# EAGLE design motionsensor (EAGLE 6.4)

## Sheet 1 of 3: Frontend
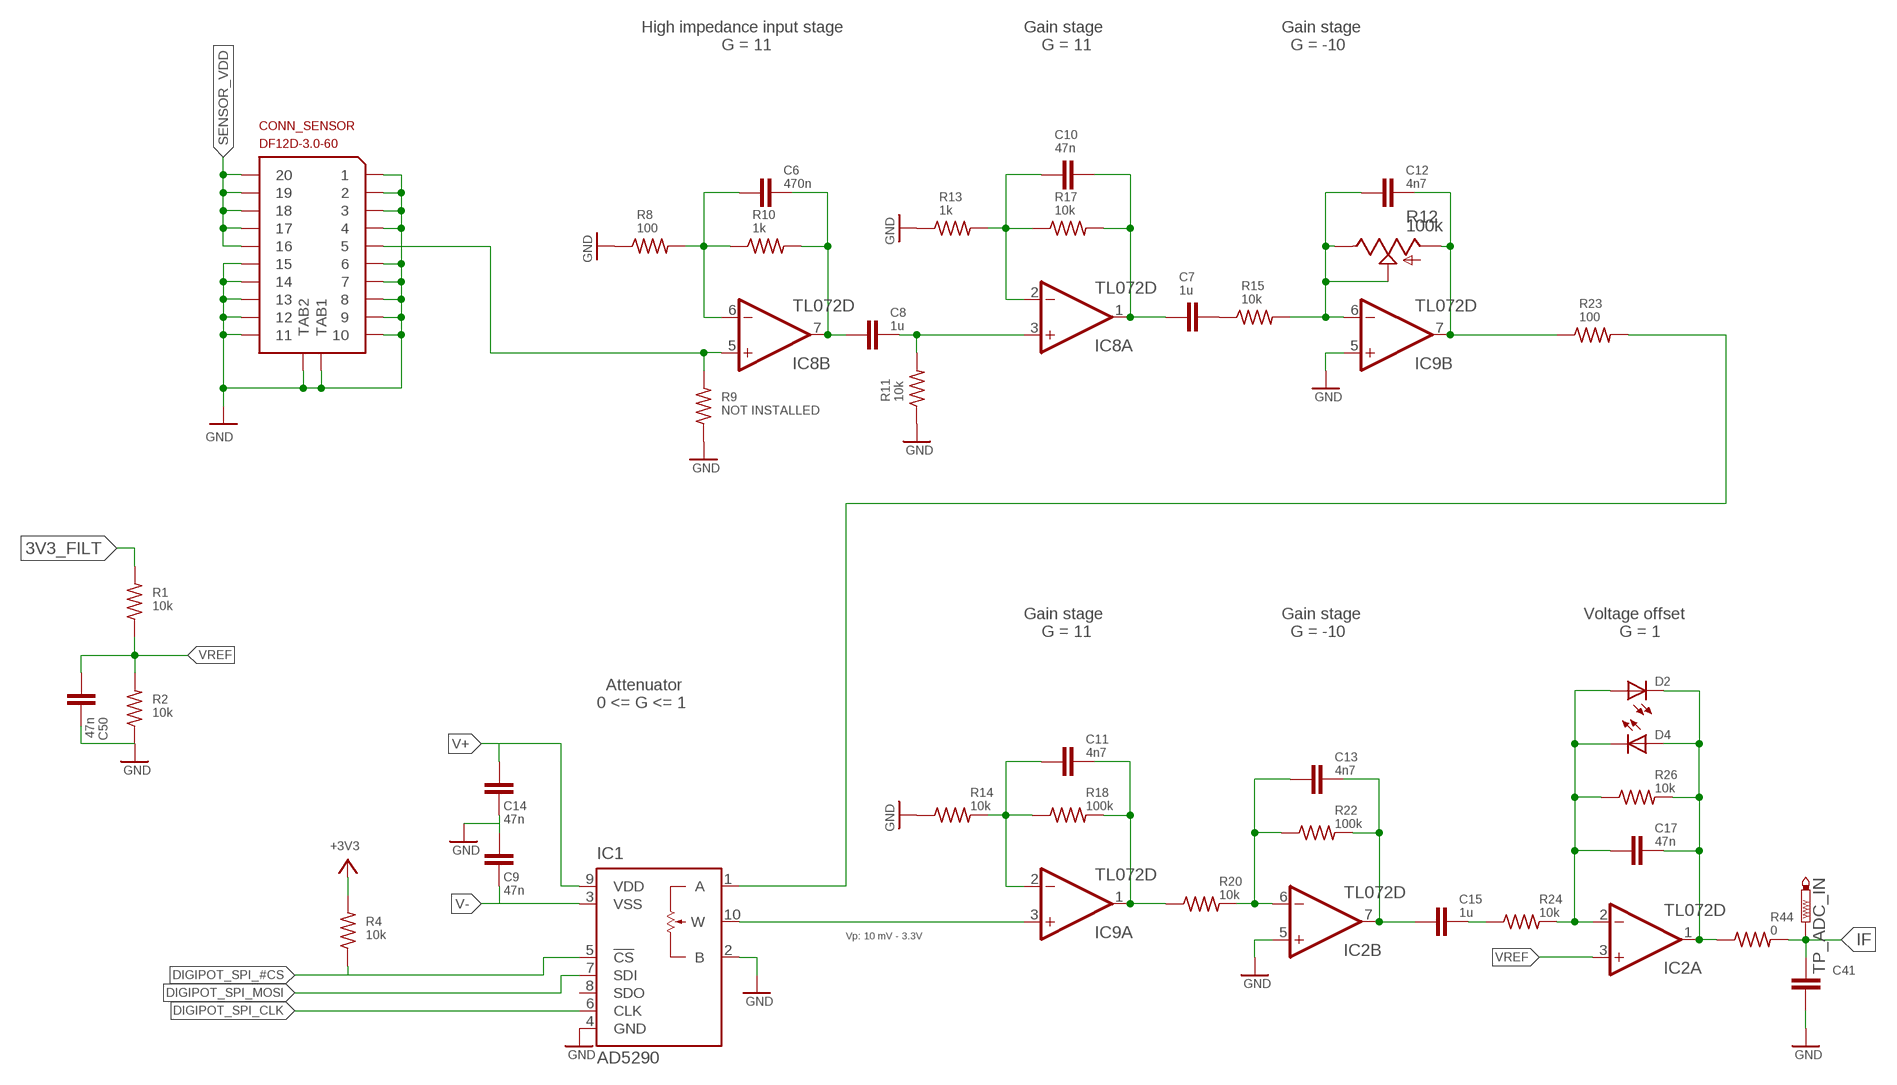
[diagram p0: schematic, sheet 1]

### Parts
C6  470n  C-EUC0603  [C0603]
C7  1u  C-EUC0603  [C0603]
C8  1u  C-EUC0603  [C0603]
C9  47n  C-EUC0603  [C0603]
C10  47n  C-EUC0603  [C0603]
C11  4n7  C-EUC0603  [C0603]
C12  4n7  C-EUC0603  [C0603]
C13  4n7  C-EUC0603  [C0603]
C14  47n  C-EUC0603  [C0603]
C15  1u  C-EUC0603  [C0603]
C17  47n  C-EUC0603  [C0603]
C41  C-EUC0603  [C0603]
C50  47n  C-EUC0603  [C0603]
CONN_SENSOR  DF12D-3.0-60  [DF12-3.0-60]
D2  LEDCHIPLED_0603  [CHIPLED_0603]
D4  LEDCHIPLED_0603  [CHIPLED_0603]
IC1  AD5290  ADS5290  [MSOP10]
IC2  TL072D  [SO08]
IC8  TL072D  [SO08]
IC9  TL072D  [SO08]
R1  10k  R-US_R0603  [R0603]
R2  10k  R-US_R0603  [R0603]
R4  10k  R-US_R0603  [R0603]
R8  100  R-US_R0603  [R0603]
R9  NOT INSTALLED  R-US_R0603  [R0603]
R10  1k  R-US_R0603  [R0603]
R11  10k  R-US_R0603  [R0603]
R12  100k  TRIM_US-3223G  [3223G]
R13  1k  R-US_R0603  [R0603]
R14  10k  R-US_R0603  [R0603]
R15  10k  R-US_R0603  [R0603]
R17  10k  R-US_R0603  [R0603]
R18  100k  R-US_R0603  [R0603]
R20  10k  R-US_R0603  [R0603]
R22  100k  R-US_R0603  [R0603]
R23  100  R-US_R0603  [R0603]
R24  10k  R-US_R0603  [R0603]
R26  10k  R-US_R0603  [R0603]
R44  0  R-US_R0603  [R0603]
TP_ADC_IN  PTR1B1,27  [B1,27]

### Nets
3V3_FILT: R1.2 ; also sheet 2,3
+3V3: R4.2 ; also sheet 2,3
DIGIPOT_SPI_#CS: IC1.5(!CS) R4.1 ; also sheet 2
DIGIPOT_SPI_CLK: IC1.6(CLK) ; also sheet 2
DIGIPOT_SPI_MOSI: IC1.7(SDI) ; also sheet 2
GND: C9.1 C14.2 C41.2 C50.2 CONN_SENSOR.P$1 CONN_SENSOR.P$2 CONN_SENSOR.P$3 CONN_SENSOR.P$4 CONN_SENSOR.P$6 CONN_SENSOR.P$7 CONN_SENSOR.P$8 CONN_SENSOR.P$9 CONN_SENSOR.P$10 CONN_SENSOR.P$11 CONN_SENSOR.P$12 CONN_SENSOR.P$13 CONN_SENSOR.P$14 CONN_SENSOR.P$15 CONN_SENSOR.TAB1 CONN_SENSOR.TAB2 IC1.2(B) IC1.4(GND) IC2.5(B:+IN) IC9.5(B:+IN) R2.1 R8.1 R9.1 R11.1 R13.1 R14.1 ; also sheet 2,3
IF: C41.1 R44.2 TP_ADC_IN.TP ; also sheet 2
N$1: C6.1 IC8.6(B:-IN) R8.2 R10.1
N$2: C6.2 C8.1 IC8.7(B:OUT) R10.2
N$3: CONN_SENSOR.P$5 IC8.5(B:+IN) R9.2
N$4: C7.2 R15.1
N$5: C10.1 IC8.2(A:-IN) R13.2 R17.1
N$6: C7.1 C10.2 IC8.1(A:OUT) R17.2
N$7: C8.2 IC8.3(A:+IN) R11.2
N$8: C12.1 IC9.6(B:-IN) R12.2(S) R12.3(E) R15.2
N$9: C12.2 IC9.7(B:OUT) R12.1(A) R23.1
N$11: IC1.1(A) R23.2
N$14: C11.1 IC9.2(A:-IN) R14.2 R18.1
N$15: C11.2 IC9.1(A:OUT) R18.2 R20.1
N$17: C13.1 IC2.6(B:-IN) R20.2 R22.1
N$18: C13.2 C15.1 IC2.7(B:OUT) R22.2
N$21: C15.2 R24.1
N$22: IC1.10(W) IC9.3(A:+IN)
N$28: C17.1 D2.A D4.C IC2.2(A:-IN) R24.2 R26.1
N$42: C17.2 D2.C D4.A IC2.1(A:OUT) R26.2 R44.1
SENSOR_VDD: CONN_SENSOR.P$16 CONN_SENSOR.P$17 CONN_SENSOR.P$18 CONN_SENSOR.P$19 CONN_SENSOR.P$20 ; also sheet 3
V+: C14.1 IC1.9(VDD) ; also sheet 3
V-: C9.2 IC1.3(VSS) ; also sheet 3
VREF: C50.1 IC2.3(A:+IN) R1.1 R2.2
Unconnected: IC1.8(SDO)

### Notes on the sheet
- High impedance input stage | Gain stage | Gain stage
- G = 11 | G = 11 | G = -10
- Gain stage | Gain stage | Voltage offset
- G = 11 | G = -10 | G = 1
- Attenuator
- 0 <= G <= 1
- Vp: 10 mV - 3.3V

## Sheet 2 of 3: MCU
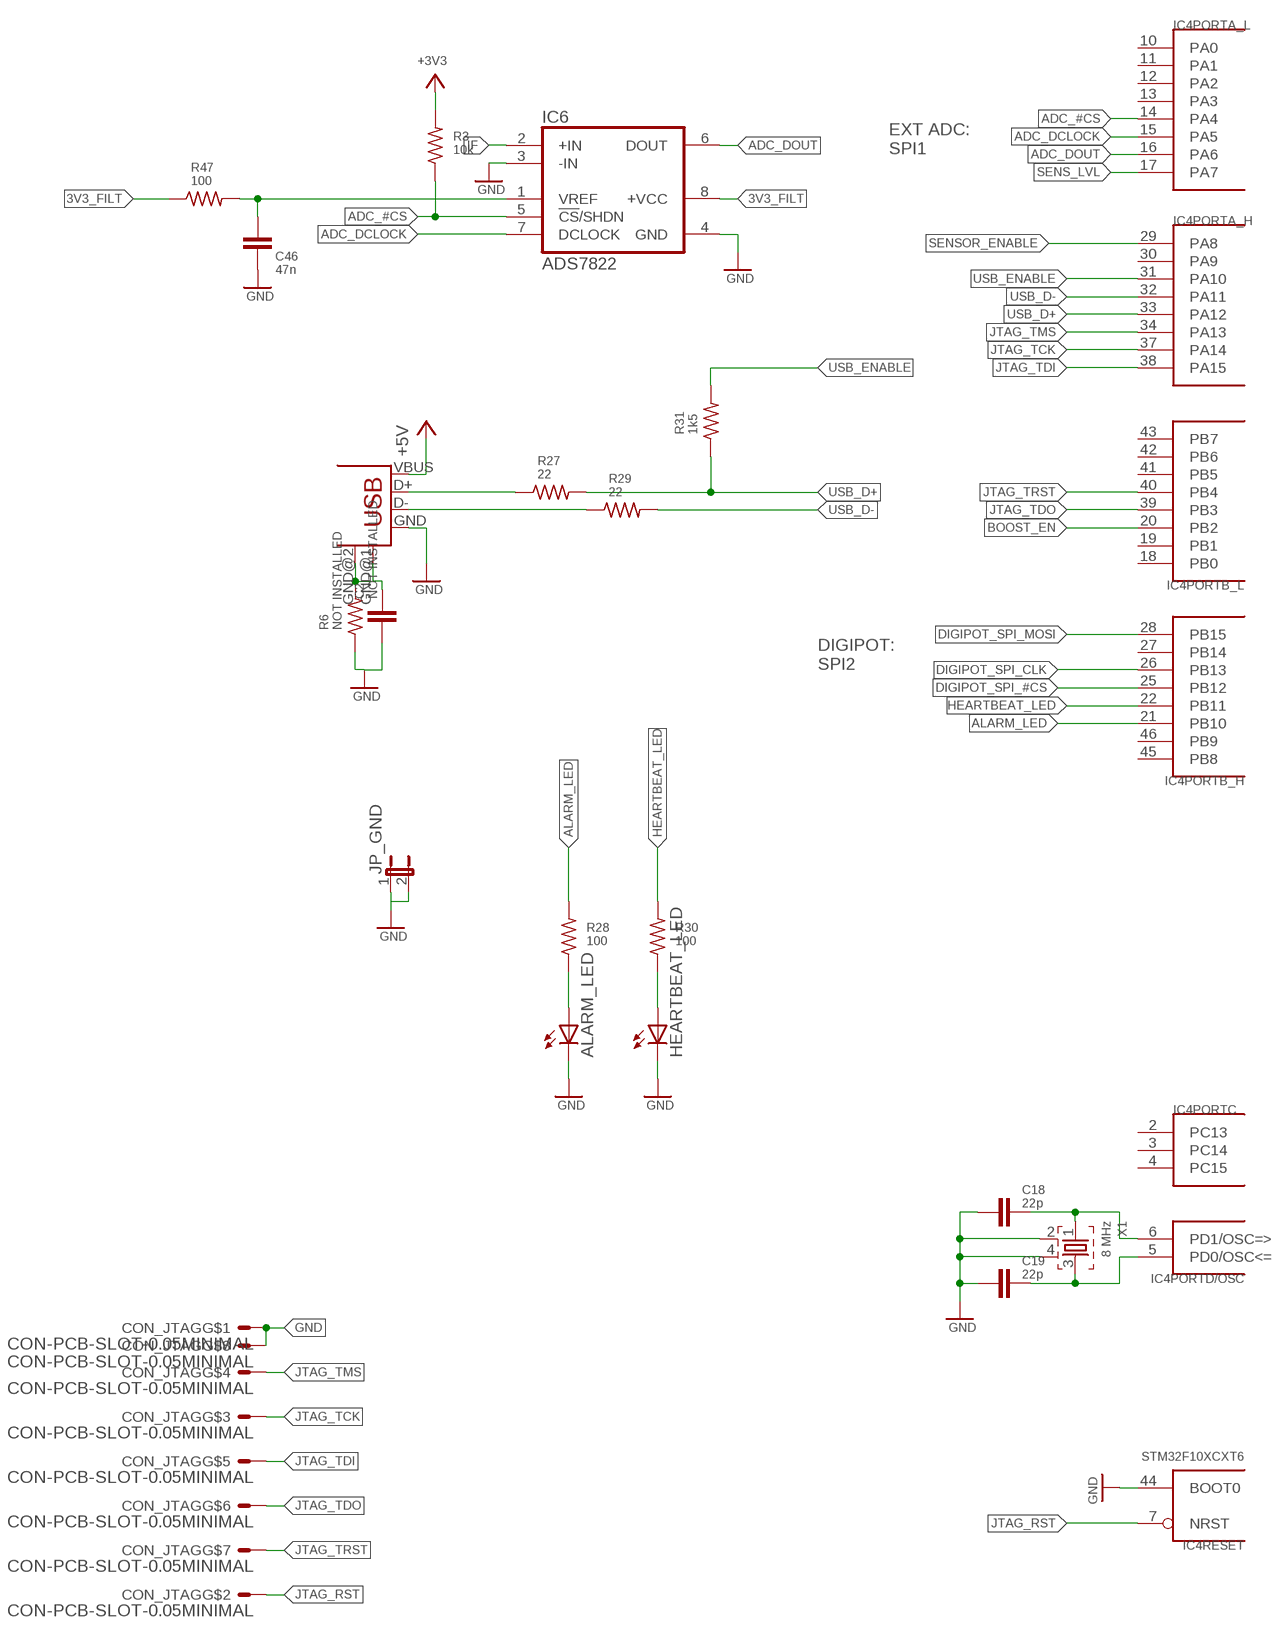
[diagram p1: schematic, sheet 2]

### Parts
ALARM_LED  LED3MM  [LED3MM]
C2  NOT INSTALLED  C-EUC0603  [C0603]
C18  22p  C-EUC0603  [C0603]
C19  22p  C-EUC0603  [C0603]
C46  47n  C-EUC0603  [C0603]
CON_JTAG  CON-PCB-SLOT-0.05MINIMAL  [CONN_SLOT_MINIMAL]
CON_USB  USB-VERT  [USB-MB-V]
HEARTBEAT_LED  LED3MM  [LED3MM]
IC4  STM32F10XCXT6  [TQFP48]
IC6  ADS7822  ADS1286U  [SO08]
JP_GND  JP1E  [JP1]
R3  10k  R-US_R0603  [R0603]
R6  NOT INSTALLED  R-US_R0603  [R0603]
R27  22  R-US_R0603  [R0603]
R28  100  R-US_R0603  [R0603]
R29  22  R-US_R0603  [R0603]
R30  100  R-US_R0603  [R0603]
R31  1k5  R-US_R0603  [R0603]
R47  100  R-US_R0603  [R0603]
X1  8 MHz  CTS406-SHIELD  [CTS406]

### Nets
3V3_FILT: IC6.8(+VCC) R47.1 ; also sheet 1,3
+3V3: R3.2 ; also sheet 1,3
ADC_#CS: IC4.14(PORTA_L:PA4) IC6.5(!CS!/SHDN) R3.1
ADC_DCLOCK: IC4.15(PORTA_L:PA5) IC6.7(DCLOCK)
ADC_DOUT: IC4.16(PORTA_L:PA6) IC6.6(DOUT)
ALARM_LED: IC4.21(PORTB_H:PB10) R28.2
BOOST_EN: IC4.20(PORTB_L:PB2) ; also sheet 3
DIGIPOT_SPI_#CS: IC4.25(PORTB_H:PB12) ; also sheet 1
DIGIPOT_SPI_CLK: IC4.26(PORTB_H:PB13) ; also sheet 1
DIGIPOT_SPI_MOSI: IC4.28(PORTB_H:PB15) ; also sheet 1
GND: ALARM_LED.K(C) C2.1 C18.1 C19.1 C46.2 CON_JTAG.1 CON_JTAG.8 CON_USB.GND HEARTBEAT_LED.K(C) IC4.44(RESET:BOOT0) IC6.3(-IN) IC6.4(GND) JP_GND.1 JP_GND.2 R6.1 X1.2 X1.4 ; also sheet 1,3
HEARTBEAT_LED: IC4.22(PORTB_H:PB11) R30.2
IF: IC6.2(+IN) ; also sheet 1
JTAG_RST: CON_JTAG.2 IC4.7(RESET:NRST)
JTAG_TCK: CON_JTAG.3 IC4.37(PORTA_H:PA14)
JTAG_TDI: CON_JTAG.5 IC4.38(PORTA_H:PA15)
JTAG_TDO: CON_JTAG.6 IC4.39(PORTB_L:PB3)
JTAG_TMS: CON_JTAG.4 IC4.34(PORTA_H:PA13)
JTAG_TRST: CON_JTAG.7 IC4.40(PORTB_L:PB4)
N$13: C2.2 CON_USB.GND@1(GND) CON_USB.GND@2(GND) R6.2
N$20: CON_USB.D+ R27.1
N$36: C46.1 IC6.1(VREF) R47.2
N$43: CON_USB.D- R29.1
N$44: C19.2 IC4.5(PORTD/OSC:PD0/OSC<=) X1.3
N$45: C18.2 IC4.6(PORTD/OSC:PD1/OSC=>) X1.1
N$46: ALARM_LED.A R28.1
N$47: HEARTBEAT_LED.A R30.1
SENS_LVL: IC4.17(PORTA_L:PA7)
SENSOR_ENABLE: IC4.29(PORTA_H:PA8) ; also sheet 3
USB_+5V: CON_USB.VBUS ; supply symbol labelled +5V ; also sheet 3
USB_D+: IC4.33(PORTA_H:PA12) R27.2 R31.1
USB_D-: IC4.32(PORTA_H:PA11) R29.2
USB_ENABLE: IC4.31(PORTA_H:PA10) R31.2
Unconnected: IC4.2(PORTC:PC13) IC4.3(PORTC:PC14) IC4.4(PORTC:PC15) IC4.10(PORTA_L:PA0) IC4.11(PORTA_L:PA1) IC4.12(PORTA_L:PA2) IC4.13(PORTA_L:PA3) IC4.18(PORTB_L:PB0) IC4.19(PORTB_L:PB1) IC4.27(PORTB_H:PB14) IC4.30(PORTA_H:PA9) IC4.41(PORTB_L:PB5) IC4.42(PORTB_L:PB6) IC4.43(PORTB_L:PB7) IC4.45(PORTB_H:PB8) IC4.46(PORTB_H:PB9)

### Notes on the sheet
- EXT ADC:
  SPI1
- DIGIPOT:
  SPI2

## Sheet 3 of 3: Power
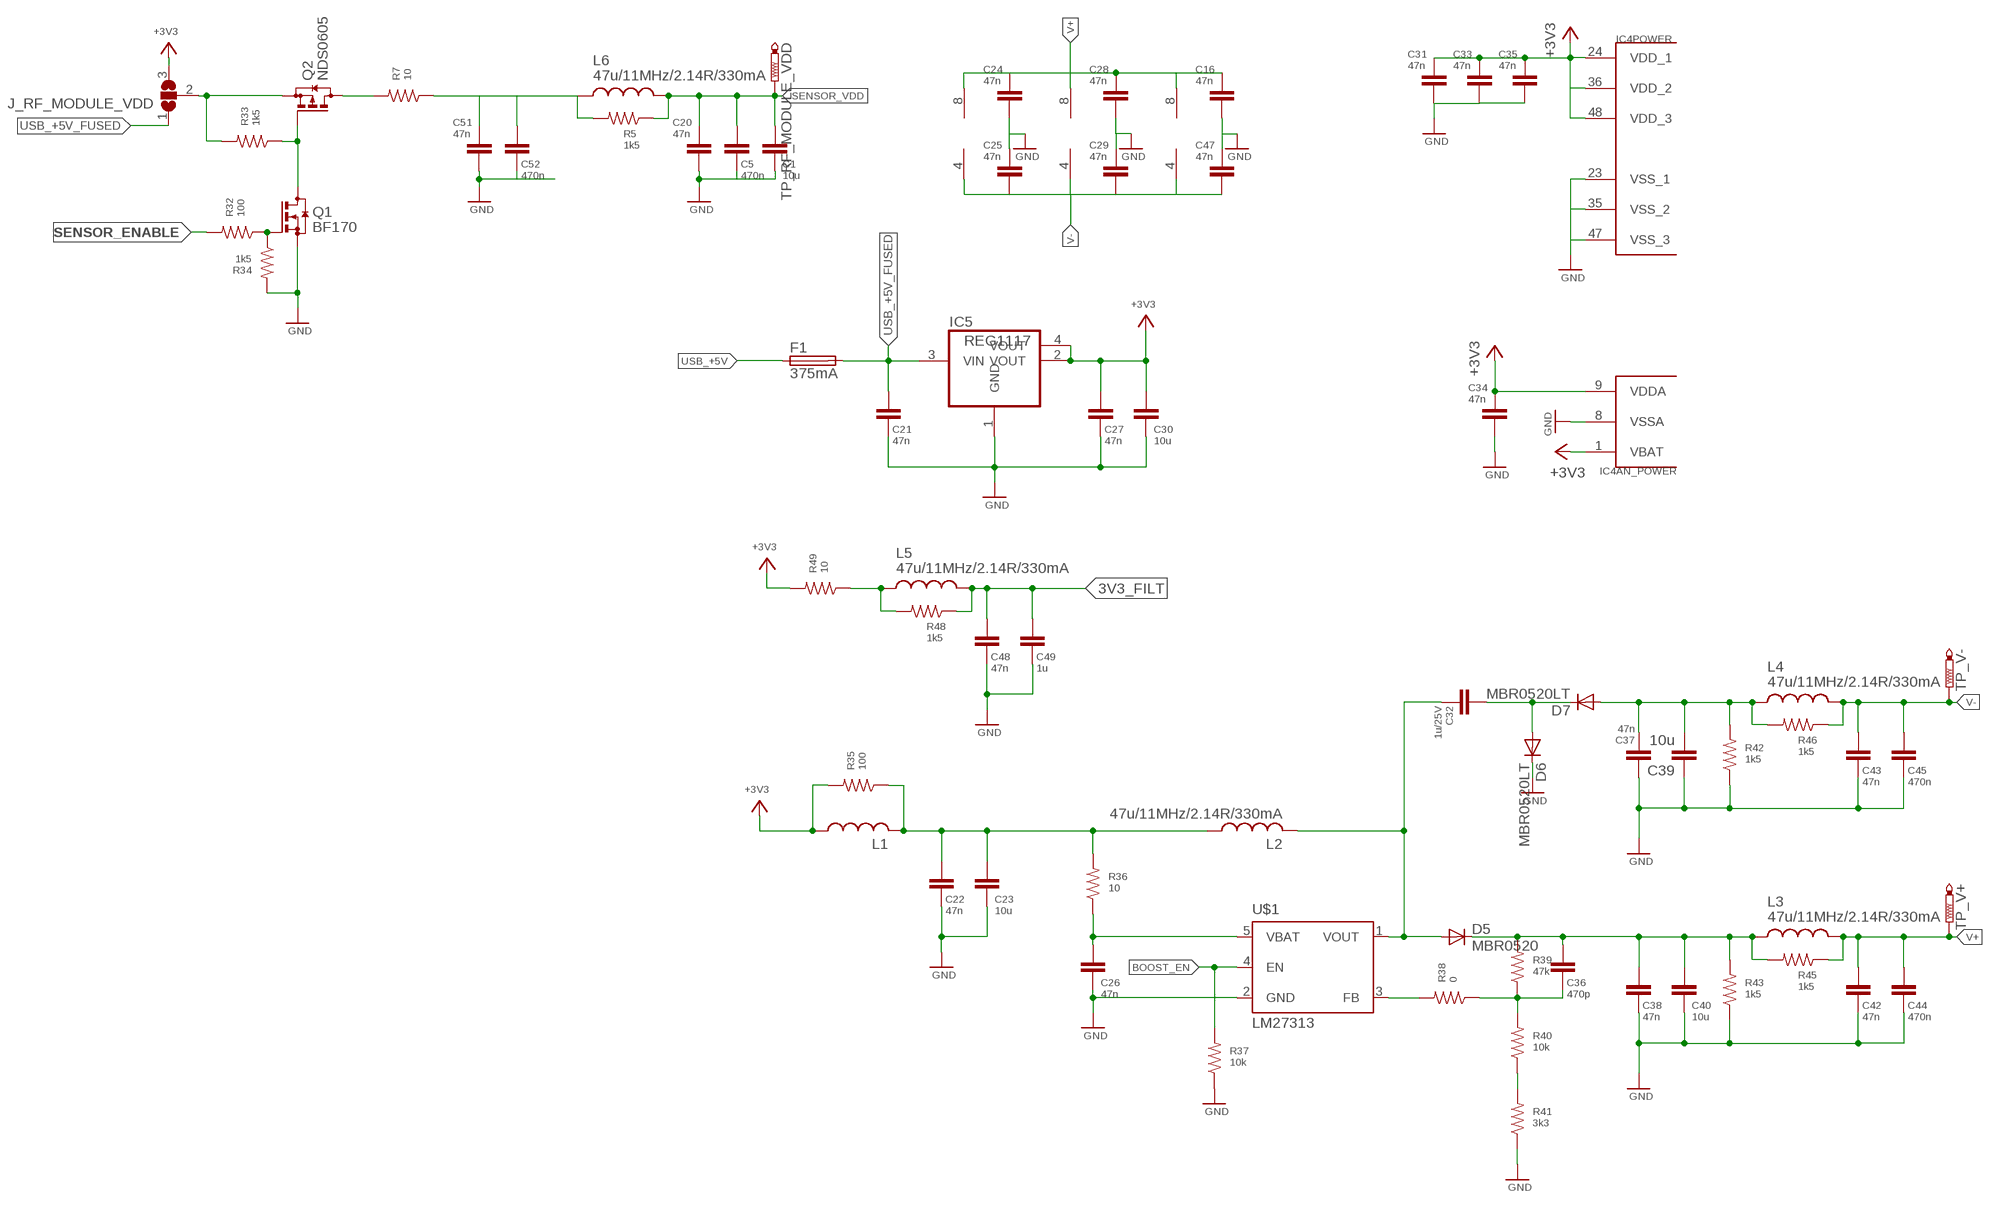
[diagram p2: schematic, sheet 3]

### Parts
C1  10u  C-EUC1206  [C1206]
C5  470n  C-EUC0603  [C0603]
C16  47n  C-EUC0603  [C0603]
C20  47n  C-EUC0603  [C0603]
C21  47n  C-EUC0603  [C0603]
C22  47n  C-EUC0603  [C0603]
C23  10u  C-EUC1206  [C1206]
C24  47n  C-EUC0603  [C0603]
C25  47n  C-EUC0603  [C0603]
C26  47n  C-EUC1206  [C1206]
C27  47n  C-EUC0603  [C0603]
C28  47n  C-EUC0603  [C0603]
C29  47n  C-EUC0603  [C0603]
C30  10u  C-EUC1206  [C1206]
C31  47n  C-EUC0603  [C0603]
C32  1u/25V  C-EUC0603  [C0603]
C33  47n  C-EUC0603  [C0603]
C34  47n  C-EUC0603  [C0603]
C35  47n  C-EUC0603  [C0603]
C36  470p  C-EUC0603  [C0603]
C37  47n  C-EUC0603  [C0603]
C38  47n  C-EUC0603  [C0603]
C39  10u  C-EUC1206  [C1206]
C40  10u  C-EUC1206  [C1206]
C42  47n  C-EUC0603  [C0603]
C43  47n  C-EUC0603  [C0603]
C44  470n  C-EUC0603  [C0603]
C45  470n  C-EUC0603  [C0603]
C47  47n  C-EUC0603  [C0603]
C48  47n  C-EUC0603  [C0603]
C49  1u  C-EUC0603  [C0603]
C51  47n  C-EUC0603  [C0603]
C52  470n  C-EUC0603  [C0603]
D5  MBR0520  MBR0520LT  [SOD123]
D6  MBR0520LT  [SOD123]
D7  MBR0520LT  [SOD123]
F1  375mA  FUSE-0603  [0603]
IC5  REG1117  [SOT223]
J_RF_MODULE_VDD  SJ2W  [SJ_2]
L1  L-USL2012C  [L2012C]
L2  47u/11MHz/2.14R/330mA  L-US1210  [R1210]
L3  47u/11MHz/2.14R/330mA  L-US1210  [R1210]
L4  47u/11MHz/2.14R/330mA  L-US1210  [R1210]
L5  47u/11MHz/2.14R/330mA  L-US1210  [R1210]
L6  47u/11MHz/2.14R/330mA  L-US1210  [R1210]
Q1  BF170  BSS123  [SOT23]
Q2  NDS0605  BSS84  [SOT23]
R5  1k5  R-US_R0603  [R0603]
R7  10  R-US_R0603  [R0603]
R32  100  R-US_R0603  [R0603]
R33  1k5  R-US_R0603  [R0603]
R34  1k5  R-US_R0603  [R0603]
R35  100  R-US_R0603  [R0603]
R36  10  R-US_R0603  [R0603]
R37  10k  R-US_R0603  [R0603]
R38  0  R-US_R0603  [R0603]
R39  47k  R-US_R0603  [R0603]
R40  10k  R-US_R0603  [R0603]
R41  3k3  R-US_R0603  [R0603]
R42  1k5  R-US_R0603  [R0603]
R43  1k5  R-US_R0603  [R0603]
R45  1k5  R-US_R0603  [R0603]
R46  1k5  R-US_R0603  [R0603]
R48  1k5  R-US_R0603  [R0603]
R49  10  R-US_R0603  [R0603]
TP_RF_MODULE_VDD  PTR1B1,27  [B1,27]
TP_V+  PTR1B1,27  [B1,27]
TP_V-  PTR1B1,27  [B1,27]
U$1  LM27313  NCP5006  [TSOP5]

### Nets
3V3_FILT: C48.1 C49.1 L5.2 R48.1 ; also sheet 1,2
+3V3: C27.1 C30.1 C31.2 C33.2 C34.2 C35.2 IC4.1(AN_POWER:VBAT) IC4.9(AN_POWER:VDDA) IC4.24(POWER:VDD_1) IC4.36(POWER:VDD_2) IC4.48(POWER:VDD_3) IC5.2(VOUT) IC5.4(VOUT) J_RF_MODULE_VDD.3 L1.1 R35.2 R49.2 ; also sheet 1,2
+3V3_FILT: C22.1 C23.1 L1.2 L2.1 R35.1 R36.2
BOOST_EN: R37.2 U$1.4(EN) ; also sheet 2
GND: C1.2 C5.2 C16.1 C20.1 C21.2 C22.2 C23.2 C24.1 C25.2 C26.2 C27.2 C28.1 C29.2 C30.2 C31.1 C33.1 C34.1 C35.1 C37.1 C38.2 C39.1 C40.2 C42.2 C43.2 C44.2 C45.2 C47.2 C48.2 C49.2 C51.1 C52.2 D6.C IC4.8(AN_POWER:VSSA) IC4.23(POWER:VSS_1) IC4.35(POWER:VSS_2) IC4.47(POWER:VSS_3) IC5.1(GND) Q1.2(S) R34.2 R37.1 R41.1 R42.1 R43.1 U$1.2(GND) ; also sheet 1,2
N$10: J_RF_MODULE_VDD.2 Q2.2(S) R33.2
N$12: Q2.3(D) R7.2
N$29: Q1.1(G) R32.1 R34.1
N$30: L5.1 R48.2 R49.1
N$31: Q1.3(D) Q2.1(G) R33.1
N$34: C32.2 D5.A L2.2 U$1.1(VOUT)
N$37: C26.1 R36.1 U$1.5(VBAT)
N$38: C32.1 D6.A D7.C
N$39: C36.2 R38.1 R39.1 R40.2
N$40: R40.1 R41.2
N$41: R38.2 U$1.3(FB)
N$141: C37.2 C39.2 D7.A L4.1 R42.2 R46.2
N$522: C36.1 C38.1 C40.1 D5.C L3.1 R39.2 R43.2 R45.2
SENSOR_ENABLE: R32.2 ; also sheet 2
SENSOR_VDD: C1.1 C5.1 C20.2 L6.2 R5.1 TP_RF_MODULE_VDD.TP ; also sheet 1
SENSOR_VDD1: C51.2 C52.1 L6.1 R5.2 R7.1
USB_+5V: F1.1 ; also sheet 2
USB_+5V_FUSED: C21.1 F1.2 IC5.3(VIN) J_RF_MODULE_VDD.1
V+: C16.2 C24.2 C28.2 C42.1 C44.1 IC2.8(P:V+) IC8.8(P:V+) IC9.8(P:V+) L3.2 R45.1 TP_V+.TP ; also sheet 1
V-: C25.1 C29.1 C43.1 C45.1 C47.1 IC2.4(P:V-) IC8.4(P:V-) IC9.4(P:V-) L4.2 R46.1 TP_V-.TP ; also sheet 1

## Library data of the parts
ALARM_LED D2 D4 HEARTBEAT_LED = led:LED: LED OSRAM: - CHIPLED LG R971, LG N971, LY N971, LG Q971, LY Q971, LO R971, LY R971 LH N974, LH R974 LS Q976, LO Q976, LY Q976 LO Q996 - Hyper CHIPLED LW Q18S LB Q993, LB Q99A, LB R99A - SideLED LS A670, LO A670, LY A670, LG A670, LP A670 LB A673, LV A673, LT A673, LW A673 LH A674 LY A675 LS A676, LA A676, LO A676, LY A676, LW A676 LS A679, LY A679, LG A679 - Hyper Micro SIDELED® LS Y876, LA Y876, LO Y876, LY Y876 LT Y87S - SmartLED LW L88C, LW L88S LB L89C, LB L89S, LG L890 LS L89K, LO L89K, LY L89K LS L896, LA L896, LO L896, LY L896 - TOPLED LS T670, LO T670, LY T670, LG T670, LP T670 LSG T670, LSP T670, LSY T670, LOP T670, LYG T670 LG T671, LOG T671, LSG T671 LB T673, LV T673, LT T673, LW T673 LH T674 LS T676, LA T676, LO T676, LY T676, LB T676, LH T676, LSB T676, LW T676 LB T67C, LV T67C, LT T67C, LS T67K, LO T67K, LY T67K, LW E67C LS E67B, LA E67B, LO E67B, LY E67B, LB E67C, LV E67C, LT E67C LW T67C LS T679, LY T679, LG T679 LS T770, LO T770, LY T770, LG T770, LP T770 LB T773, LV T773, LT T773, LW T773 LH T774 LS E675, LA E675, LY E675, LS T675 LS T776, LA T776, LO T776, LY T776, LB T776 LHGB T686 LT T68C, LB T68C - Hyper Mini TOPLED® LB M676 - Mini TOPLED Santana® LG M470 LS M47K, LO M47K, LY M47K Source: http://www.osram.convergy.de LUXEON: - LUMILED® LXK2-PW12-R00, LXK2-PW12-S00, LXK2-PW14-U00, LXK2-PW14-V00 LXK2-PM12-R00, LXK2-PM12-S00, LXK2-PM14-U00 LXK2-PE12-Q00, LXK2-PE12-R00, LXK2-PE12-S00, LXK2-PE14-T00, LXK2-PE14-U00 LXK2-PB12-K00, LXK2-PB12-L00, LXK2-PB12-M00, LXK2-PB14-N00, LXK2-PB14-P00, LXK2-PB14-Q00 LXK2-PR12-L00, LXK2-PR12-M00, LXK2-PR14-Q00, LXK2-PR14-R00 LXK2-PD12-Q00, LXK2-PD12-R00, LXK2-PD12-S00 LXK2-PH12-R00, LXK2-PH12-S00 LXK2-PL12-P00, LXK2-PL12-Q00, LXK2-PL12-R00 Source: www.luxeon.com KINGBRIGHT: KA-3528ASYC Source: www.kingbright.com
C1 C2 C5-C52 = rcl:C-EU: CAPACITOR, European symbol
CON_JTAG = con-pcb-slot:CON-PCB-SLOT-0.05: PCB slot (edge) connector with 0.05" pitch (based on conventional PCI)
CON_USB = con-usb-2:USB: USB Connectors
CONN_SENSOR = con-hirose-DF12-20:DF12D-3.0-60
D5-D7 = diode:MBR0520LT: SCHOTTKY BARRIER RECTIFIER Source: http://onsemi.com .. MBR0520LT1-D.pdf
F1 = fuse-0603:FUSE-0603
IC1 = ADS5290:ADS5290: Single +15 V/±5 V, 256-Position, I2C-Compatible Digital Potentiometer Source: http://www.analog.com/static/imported-files/data_sheets/AD5280_5282.pdf
IC2 IC8 IC9 = linear:TL072: OP AMP
IC4 = stm32:STM32F10XCXT6: ST STM32F101/103 48pin LQFP
IC5 = burr-brown:REG1117: 800mA and 1A Low Dropout (LDO) Positive Regulator 1.8V, 2.5V, 2.85V, 3.3V, 5V, and Adj; MPN: REG1117; OC_FARNELL: 1097566; OC_NEWARK: 14P6981
IC6 = burr-brown:ADS1286: 12-Bit Micro Power Sampling ADC; MF: TEXAS INSTRUMENTS; MPN: ADS1286U; OC_FARNELL: 1106203; OC_NEWARK: 80K5544
J_RF_MODULE_VDD = jumper:SJ2W: SMD solder JUMPER
JP_GND = jumper:JP1E: JUMPER
L1 = rcl:L-US: INDUCTOR, American symbol
L2-L6 = rcl - Copy:L-US: INDUCTOR, American symbol
Q1 = transistor-small-signal:BSS123: N-CHANNEL MOS FET
Q2 = transistor-small-signal:BSS84: P-CHANNEL MOS FET
R1-R11 R13-R15 R17 R18 R20 R22-R24 R26-R49 = rcl:R-US_: RESISTOR, American symbol
R12 = pot:TRIM_US-: POTENTIOMETER
TP_ADC_IN TP_RF_MODULE_VDD TP_V+ TP_V- = testpad:PTR1: TEST PIN
U$1 = ncp5006:NCP5006
X1 = crystal:CTS406-SHIELD

## Board
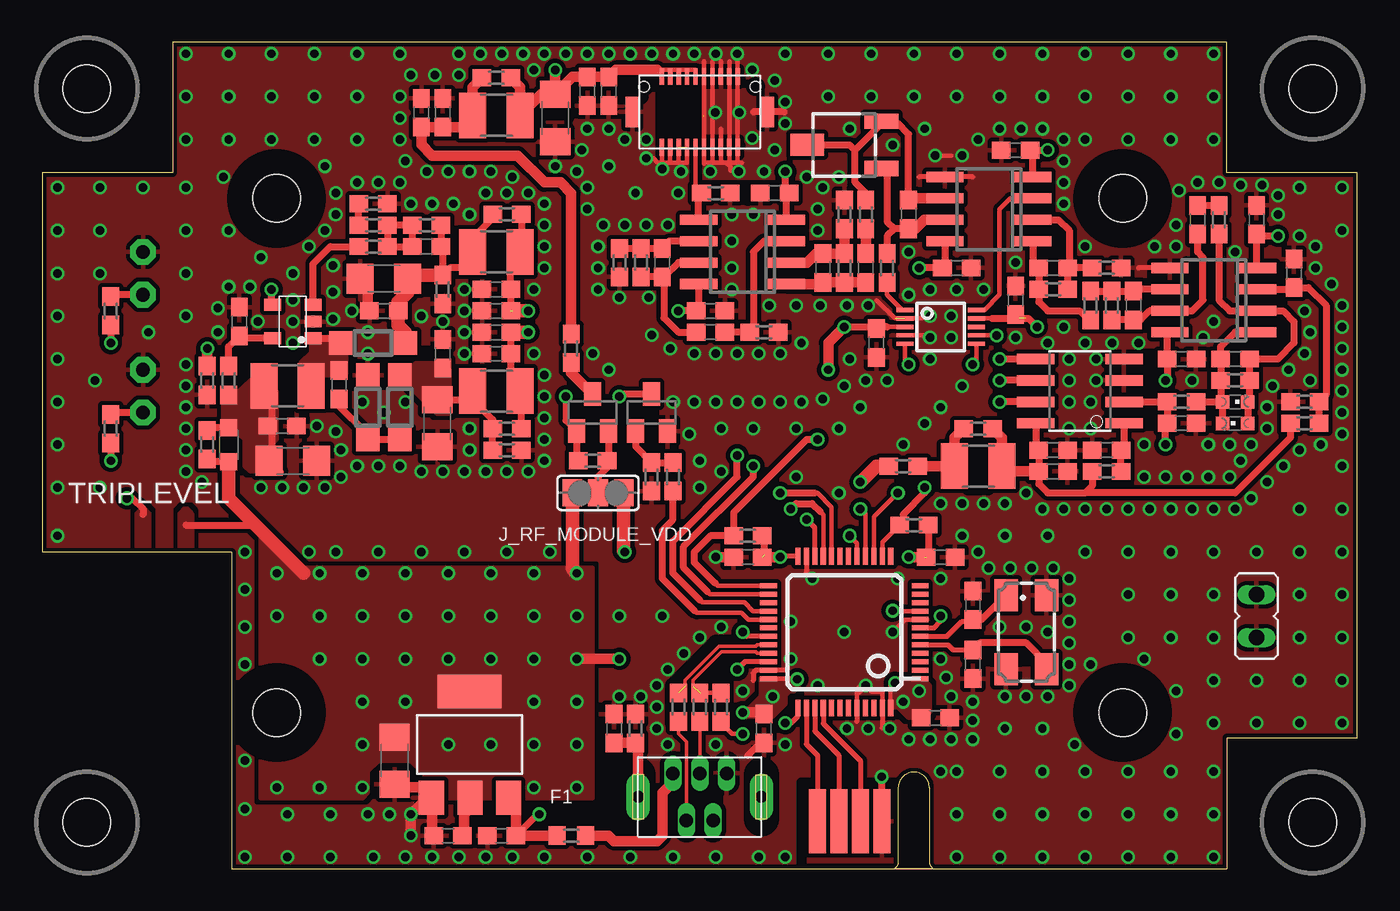
[diagram p3: board, top side]
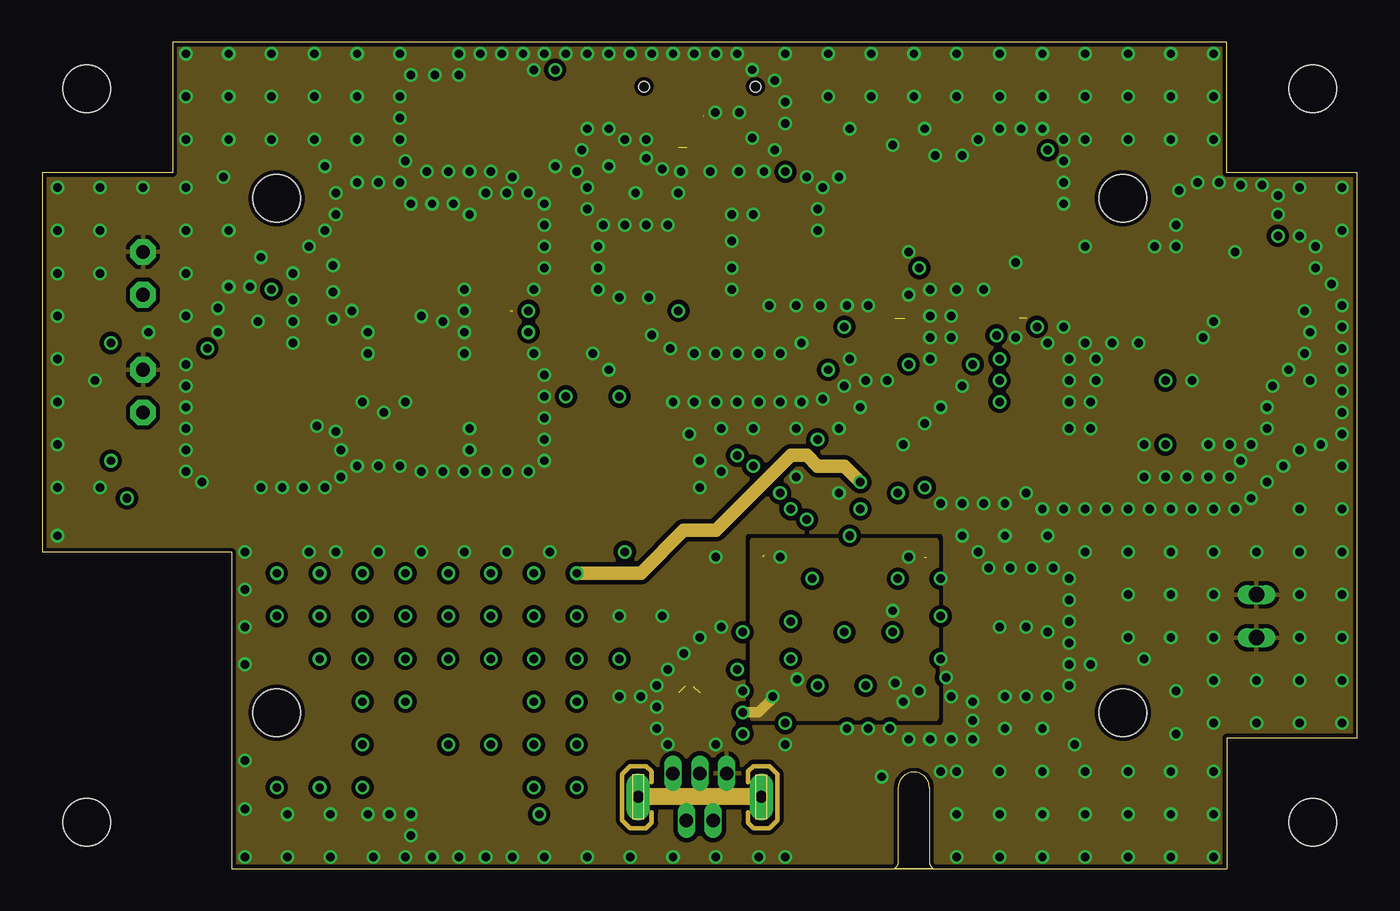
[diagram p4: board, inner layer Route2]
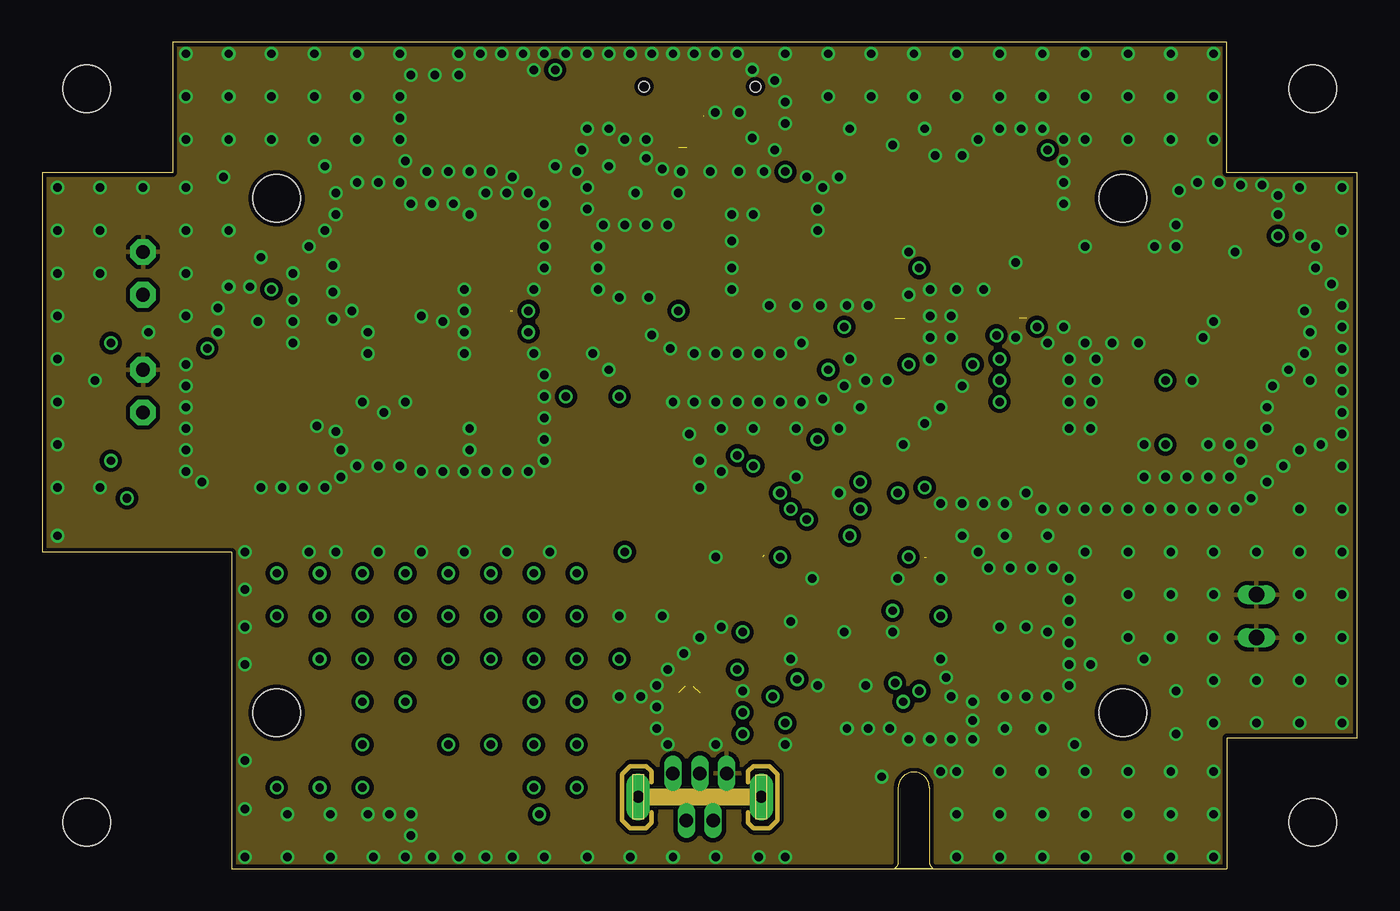
[diagram p5: board, inner layer Route15]
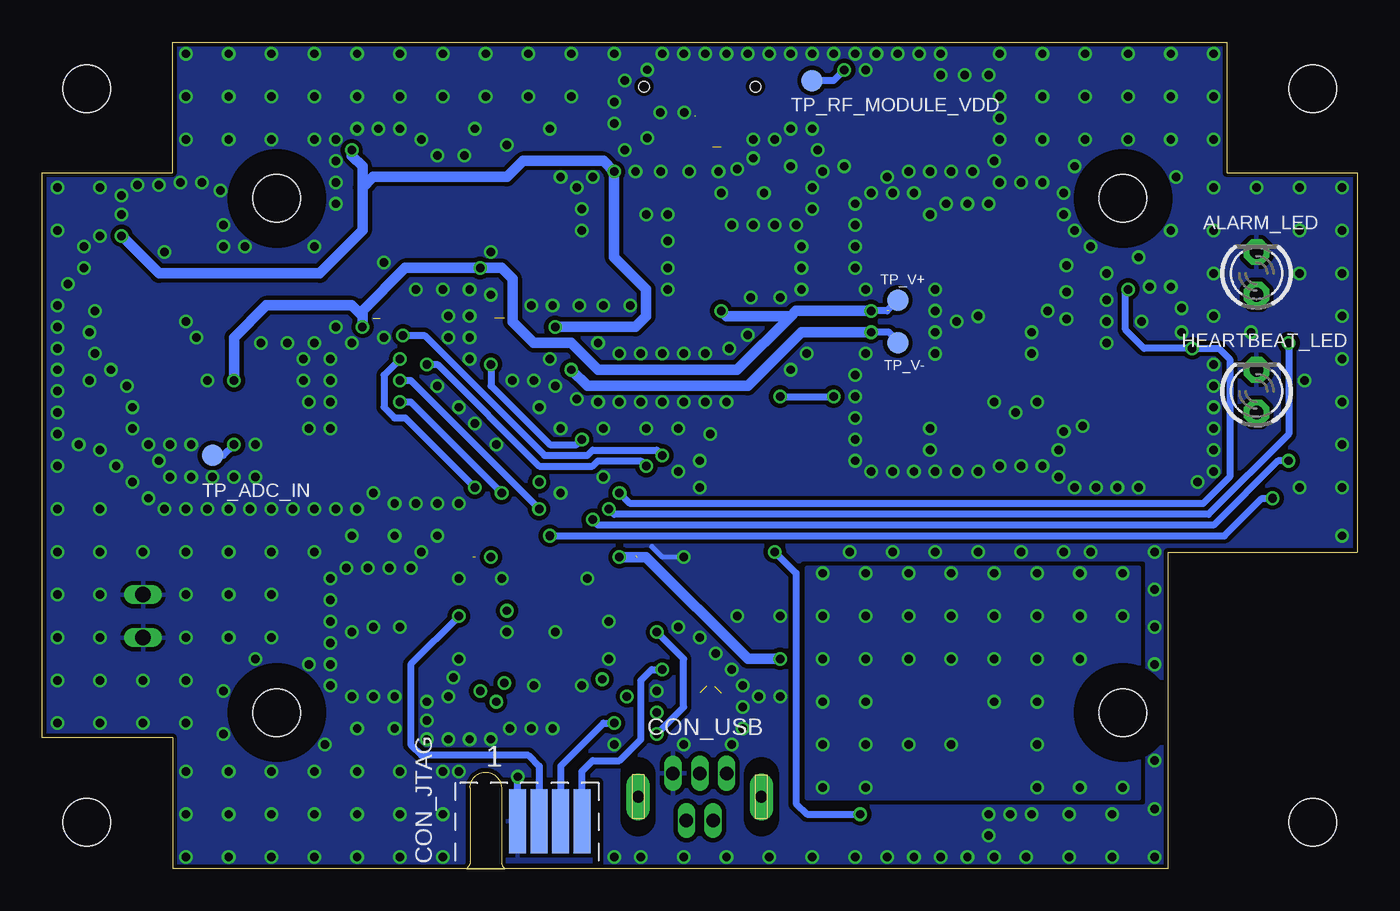
[diagram p6: board, bottom side, seen from below]

Size 78 x 49 mm. Coordinates in mm from the lower left corner, seen from the top.
Outline: 11.25,0 70.25,0 70.25,7.75 78,7.75 78,41.25 70.25,41.25 70.25,49 7.75,49 7.75,41.25 0,41.25 0,18.75 11.25,18.75 11.25,0
Copper layers (1*2*15*16): Top 0.035mm / dielectric 0.2mm / Route2 0.0175mm / dielectric 1.1mm / Route15 0.0175mm / dielectric 0.2mm / Bottom 0.035mm
Design rules "SeeedStudio_DRU_no_angle_20130527 *": minimum track width 6mil, minimum drill 12mil, track to track 6mil, track to pad 6mil, pad to pad 6mil, via to via 6mil, smd to smd 0mil, copper to edge 10mil, drill to drill 10mil, minimum pad ring 4mil, minimum via ring 6mil, stop-mask expansion 2mil, vias tented up to drill 25mil, thermal gap 10mil
Holes 2.8 mm at 13.9,9.25 64.1,9.25 64.1,39.75 13.9,39.75 2.65,46.25 2.65,2.75 75.35,2.75 75.35,46.25
tRestrict: area 11.4,6.7 to 16.4,11.8; area 11.4,37.2 to 16.4,42.3; area 61.5,6.7 to 66.6,11.8; area 61.5,37.2 to 66.6,42.3; area 36.8,42.2 to 38.8,46.5; 38 lines
bRestrict: area 61.5,37.2 to 66.6,42.3; area 11.4,6.7 to 16.4,11.8; area 11.4,37.2 to 16.4,42.3; area 61.5,6.7 to 66.6,11.8

### Footprints (pad centres in the part's own frame; a part is rotated, then mirrored left to right if it is on the bottom)
LED3MM = drill 0.813 pad 1.524 octagon: A -1.27,0; K 1.27,0
C1206 = smd 1.6 x 1.8: 1 -1.4,0; 2 1.4,0
C0603 = smd 1.1 x 1: 1 -0.85,0; 2 0.85,0
CONN_SLOT_MINIMAL = smd 1.016 x 3.81: 1 -1.905,0.275; 2 -0.635,0.275; 3 0.635,0.275; 4 1.905,0.275 | smd 1.016 x 3.81 bottom: 5 1.905,0.275; 6 0.635,0.275; 7 -0.635,0.275; 8 -1.905,0.275
USB-MB-V = drill 0.8 pad 1.05 long: D+ 1.4,0; D- -1.4,-0.8; GND 1.4,1.6; ID -1.4,0.8; VBUS 1.4,-1.6 | drill 0.7 pad 1.4 long: GND@1 0,3.65; GND@2 0,-3.65
DF12-3.0-60 = smd 1 x 0.25: P$1 -2.1,2.25; P$2 -2.1,1.75; P$3 -2.1,1.25; P$4 -2.1,0.75; P$5 -2.1,0.25; P$6 -2.1,-0.25; P$7 -2.1,-0.75; P$8 -2.1,-1.25; P$9 -2.1,-1.75; P$10 -2.1,-2.25; P$11 2.1,-2.25; P$12 2.1,-1.75; P$13 2.1,-1.25; P$14 2.1,-0.75; P$15 2.1,-0.25; P$16 2.1,0.25; P$17 2.1,0.75; P$18 2.1,1.25; P$19 2.1,1.75; P$20 2.1,2.25 | smd 1.8 x 0.8: TAB1 0,4; TAB2 0,-4 | hole 0.6: 1.5,-3.3; 1.5,3.3
CHIPLED_0603 = smd 0.8 x 0.8: A 0,-0.75; C 0,0.75
SOD123 = smd 1.4 x 1.4: A 1.9,0; C -1.9,0
0603 = smd 1 x 1.1: 1 -0.85,0; 2 0.85,0
MSOP10 = smd 0.25 x 1: 1 -1,-2.113; 2 -0.5,-2.113; 3 0,-2.113; 4 0.5,-2.113; 5 1,-2.113; 6 1,2.113; 7 0.5,2.113; 8 0,2.113; 9 -0.5,2.113; 10 -1,2.113
SO08 = smd 0.6 x 2.2: 1 -1.905,-2.6; 2 -0.635,-2.6; 3 0.635,-2.6; 4 1.905,-2.6; 5 1.905,2.6; 6 0.635,2.6; 7 -0.635,2.6; 8 -1.905,2.6
TQFP48 = smd 0.3 x 1: 1 -2.75,-4.5; 2 -2.25,-4.5; 3 -1.75,-4.5; 4 -1.25,-4.5; 5 -0.75,-4.5; 6 -0.25,-4.5; 7 0.25,-4.5; 8 0.75,-4.5; 9 1.25,-4.5; 10 1.75,-4.5; 11 2.25,-4.5; 12 2.75,-4.5; 25 2.75,4.5; 26 2.25,4.5; 27 1.75,4.5; 28 1.25,4.5; 29 0.75,4.5; 30 0.25,4.5; 31 -0.25,4.5; 32 -0.75,4.5; 33 -1.25,4.5; 34 -1.75,4.5; 35 -2.25,4.5; 36 -2.75,4.5 | smd 1 x 0.3: 13 4.5,-2.75; 14 4.5,-2.25; 15 4.5,-1.75; 16 4.5,-1.25; 17 4.5,-0.75; 18 4.5,-0.25; 19 4.5,0.25; 20 4.5,0.75; 21 4.5,1.25; 22 4.5,1.75; 23 4.5,2.25; 24 4.5,2.75; 37 -4.5,2.75; 38 -4.5,2.25; 39 -4.5,1.75; 40 -4.5,1.25; 41 -4.5,0.75; 42 -4.5,0.25; 43 -4.5,-0.25; 44 -4.5,-0.75; 45 -4.5,-1.25; 46 -4.5,-1.75; 47 -4.5,-2.25; 48 -4.5,-2.75
SOT223 = smd 1.499 x 2.007: 1 -2.261,-3.15; 2 0.025,-3.15; 3 2.311,-3.15 | smd 3.81 x 2.007: 4 0,3.15
SO08' = smd 0.61 x 2.21: 1 -1.905,-2.616; 2 -0.635,-2.616; 3 0.635,-2.616; 4 1.905,-2.616; 5 1.905,2.616; 6 0.635,2.616; 7 -0.635,2.616; 8 -1.905,2.616
SJ_2 = smd 1.168 x 1.6: 1 -1.524,0; 2 0,0; 3 1.524,0
JP1 = drill 0.914 long: 1 0,-1.27; 2 0,1.27
L2012C = smd 1 x 1: 1 -1,0; 2 1,0
R1210 = smd 1.6 x 2.7: 1 -1.4,0; 2 1.4,0
SOT23 = smd 1 x 1.4: 1 -0.95,-1.1; 2 0.95,-1.1; 3 0,1.1
R0603 = smd 1.1 x 1: 1 -0.85,0; 2 0.85,0
3223G = smd 2 x 0.9: 1 -2.2,1.4; 3 -2.2,-1.4 | smd 2 x 1.3: 2 2.2,0
B1,27 = smd 1.27 x 1.27: TP 0,0
TSOP5 = smd 0.7 x 1: 1 -0.99,-1.2; 2 0,-1.2; 3 0.99,-1.2; 4 0.99,1.2; 5 -0.99,1.2
CTS406 = smd 1.9 x 1.4: 1 -2.2,-1.2; 2 2.2,-1.2; 3 2.2,1.2; 4 -2.2,1.2

### Placement (x,y rotation side)
ALARM_LED  5.98,35.3 90 bottom
C1  30.43,44.5 270 top
C2  33.92,8.31 270 top
C5  32.33,46.09 270 top
C6  36.78,35.93 270 top
C7  48.84,35.61 90 top
C8  39.63,31.8 0 top
C9  49.48,31.17 90 top
C10  46.3,35.61 270 top
C11  59.95,35.61 180 top
C12  51.38,38.79 270 top
C13  64.72,33.39 270 top
C14  57.73,33.71 90 top
C15  68.53,38.47 90 top
C16  67.58,30.21 180 top
C17  70.75,30.21 180 top
C18  55.19,15.61 270 top
C19  55.19,12.12 90 top
C20  33.6,46.09 90 top
C21  27.25,1.96 180 top
C22  14.23,26.24 0 top
C23  14.87,24.18 0 top
C24  39.63,33.07 180 top
C25  43.45,40.06 180 top
C26  47n  [C0603]  11.7,32.44 90 top
C27  24.08,1.96 180 top
C28  54.24,35.61 180 top
C29  57.73,42.6 180 top
C30  20.9,6.4 270 top
C31  52.97,8.94 180 top
C32  17.62,28.68 90 top
C33  42.81,8.31 90 top
C34  53.29,18.47 180 top
C35  41.86,18.47 0 top
C36  22.81,36.88 180 top
C37  23.76,30.53 270 top
C38  20.27,33.07 180 top
C39  23.44,26.41 90 top
C40  20.27,34.98 180 top
C41  67.58,26.41 0 top
C42  26.94,34.34 180 top
C43  26.94,30.53 180 top
C44  26.94,33.07 180 top
C45  26.94,31.8 180 top
C46  63.13,24.82 180 top
C47  72.02,38.47 90 top
C48  59.95,24.82 0 top
C49  59.95,23.55 0 top
C50  74.24,35.3 90 top
C51  23.76,44.82 270 top
C52  22.49,44.82 90 top
CON_JTAG  47.89,2.54 0 bottom
CON_USB  39,4.26 90 bottom
CONN_SENSOR  39,44.86 90 top
D2  70.75,26.41 90 top
D4  70.75,27.68 270 top
D5  19.63,31.17 180 top
D6  19.32,27.36 270 top
D7  21.22,27.36 90 top
F1  31.38,1.96 180 top
HEARTBEAT_LED  5.98,28.31 90 bottom
IC1  53.29,32.12 270 top
IC2  69.48,33.71 90 top
IC4  47.57,14.02 90 top
IC5  25.35,7.36 0 top
IC6  ADS7822  [SO08']  61.54,28.31 90 top
IC8  41.54,36.56 90 top
IC9  56.14,39.11 90 top
J_RF_MODULE_VDD  32.97,22.28 180 top
JP_GND  72.02,14.97 0 top
L1  11.06,25.14 90 top
L2  14.55,28.63 0 top
L3  26.94,36.56 0 top
L4  26.94,28.31 0 top
L5  55.51,23.86 0 top
L6  26.94,44.66 0 top
Q1  36.14,27.04 0 top
Q2  32.65,27.04 0 top
R1  74.88,26.41 180 top
R2  74.88,27.68 0 top
R3  51.7,20.37 0 top
R4  41.86,19.74 0 top
R5  26.94,46.88 180 top
R6  35.19,8.31 270 top
R7  31.38,30.85 270 top
R8  34.24,35.93 90 top
R9  39.95,40.06 180 top
R10  35.51,35.93 270 top
R11  42.81,31.8 180 top
R12  47.57,42.91 180 top
R13  47.57,38.79 270 top
R14  63.13,35.61 180 top
R15  48.84,38.79 90 top
R17  47.57,35.61 270 top
R18  59.95,34.34 180 top
R20  62.18,33.39 90 top
R22  63.45,33.39 270 top
R23  50.11,35.61 270 top
R24  69.8,38.47 270 top
R26  70.75,28.95 180 top
R27  39,9.58 90 top
R28  4.08,33.07 270 top
R29  37.73,9.58 90 top
R30  4.08,26.09 270 top
R31  40.27,9.58 270 top
R32  37.41,23.23 270 top
R33  32.65,24.18 0 top
R34  36.14,23.23 270 top
R35  9.79,25.14 270 top
R36  11.06,28.95 270 top
R37  9.79,28.95 90 top
R38  19.63,36.88 180 top
R39  22.81,38.15 0 top
R40  19.63,38.15 0 top
R41  19.63,39.42 180 top
R42  27.57,24.82 180 top
R43  23.76,34.34 90 top
R44  67.58,27.68 180 top
R45  27.57,38.79 180 top
R46  27.57,26.09 180 top
R47  63.13,23.55 0 top
R48  55.51,26.09 180 top
R49  51.06,23.86 180 top
TP_ADC_IN  67.89,24.5 0 bottom
TP_RF_MODULE_VDD  32.33,46.73 0 bottom
TP_V+  27.25,33.71 270 bottom
TP_V-  27.25,31.17 270 bottom
U$1  14.87,32.44 90 top
X1  58.37,14.02 270 top

### Tracks (layer width: path | path; a pad name or v marks a point on that pad's centre or on a via)
3V3_FILT
  Top 0.406: IC6.8 58.93,25 C48.1 C49.1 59.11,22.81 59.64,22.28 61.86,22.28 | 61.86,22.28 62.28,22.7 R47.1 | 61.86,22.28 70.75,22.28 74.03,25.55 R1.2 | 57.2,23.55 57.2,23.57 L5.2
  Top 0.61: R48.1 56.91,25.54 L5.2 | 57.2,23.55 C49.1
+3V3  (via drill 0.5, 0.5 pad 0.61)  (2 unrouted)
  Top 0.254: IC4.36 44.82,11.27 v44.78,11.23 | IC4.48 50.32,10.93 50.66,11.27 IC4.1 | 50.68,11.29 50.65,11.29 50.48,11.12 v50.59,11.01 | 43.82,18.52 v43.76,18.47 | IC4.9 50.45,15.27 v50.43,15.29
  Top 0.305: IC4.24 43.82,18.52
  Top 0.406: 8.52,20.37 12.65,20.37 | R4.2 42.81,19.74 42.81,18.57 | L1.1 9.94,24.14 R35.2 | R3.2 52.55,18.58 C34.2
  Top 0.61: 52.34,18.47 v51.38,18.47 | C35.2 v43.76,18.47 | IC5.2 25.37,3.57 25.03,3.23 25.03,2.06 C27.1 | v41.54,9.26 42.71,9.26 C33.2 | v34.24,12.44 32.02,12.44
  Top 0.813: L1.1 11.06,21.96 12.65,20.37 15.5,17.52 | J_RF_MODULE_VDD.3 31.44,17.77 v31.7,17.52 | R49.2 49.48,23.86 v48.52,22.91
  Route2 0.61: v41.54,9.26 42.49,9.26 43.32,10.09 v43.32,10.21
  Route2 0.813: v48.52,22.91 47.57,23.86 45.98,23.86 45.35,24.5 44.4,24.5 39.95,20.05 38.05,20.05 35.51,17.52 v31.7,17.52
  Bottom 0.61: v43.76,18.47 42.17,18.47 36.14,12.44 v34.24,12.44
  other vias: 52.02,10.53 51.07,9.89 24.08,12.44 26.62,12.44 29.16,12.44 31.7,12.44 21.54,12.44 19,12.44 16.46,12.44 16.46,14.97 19,14.97 21.54,14.97 24.08,14.97 26.62,14.97 29.16,14.97 31.7,14.97 29.16,17.52 26.62,17.52 24.08,17.52 21.54,17.52 19,17.52 16.46,17.52 13.92,17.52 13.92,14.97 19,9.89 21.54,9.89 19,7.36 29.16,9.89 31.7,9.89 31.7,7.36 29.16,7.36 26.62,7.36 24.08,7.36 19,4.82 16.46,4.82 13.92,4.82 29.16,4.82 31.7,4.82
  pour Route2 (isolate 0.254, rank 2): 42.17,8.94 42.17,19.42 52.97,19.42 52.97,8.94
  pour Top (isolate 0.254, rank 2, no thermals): 32.65,4.18 24.08,4.18 21.86,6.4 19.95,6.4 19.32,5.77 19.32,4.5 19,4.18 12.96,4.18 12.96,20.37 15.5,17.83 32.65,17.83
  pour Top (rank 3, no thermals): 50.43,11.16 52.34,11.16 52.65,10.85 52.65,9.26 52.34,8.94 51.38,8.94 50.75,9.58 50.43,9.58
  pour Bottom (isolate 0.254, rank 2, no thermals): 32.65,4.18 12.96,4.18 12.96,17.83 32.65,17.83
  pour Top (rank 3, no thermals): 42.62,11.29 44.84,11.29 44.84,10.78 44.59,10.53 44.33,10.53 44.08,10.28 44.08,9.77 43.32,9.01 41.54,9.01 41.73,9.32 42.62,10.21
  pour Top: 8.84,21.01 8.52,21.32 8.2,21.01 8.2,19.1 8.84,19.1
+3V3_FILT
  Top 0.406: L2.1 13.15,28.76 13.6,28.31 13.6,24.18 | 14.13,23.52 C23.1 | L1.2 9.94,26.14 R35.1
  pour Top (rank 2, no thermals): 12.96,29.26 13.92,28.31 13.92,25.45 13.6,25.14 13.6,23.86 13.28,23.55 12.33,23.55 12.01,23.86 12.01,25.45 11.7,25.77 11.06,25.77 10.74,26.09 10.74,27.99 11.06,28.31 11.7,28.31 12.65,29.26
ADC_#CS  (via drill 0.5, 0.51 pad 0.61)
  Top 0.254: IC4.14 49.82,19.34 R3.1
  Top 0.406: IC6.5 v56.78,30.21 | v52.34,22.59 52.34,22.28 51.06,21.01 51.06,20.59 R3.1
  Bottom 0.406: v56.78,30.21 57.73,29.26 57.73,27.36 57.1,26.72 56.46,26.72 v52.34,22.59
ADC_DCLOCK  (via drill 0.5, 0.51 pad 0.61)
  Top 0.254: IC4.15 49.32,20.85 v50.75,22.28
  Top 0.406: IC6.7 v56.78,27.68
  Bottom 0.406: v56.78,27.68 56.14,27.68 v50.75,22.28
ADC_DOUT  (via drill 0.5, 0.51 pad 0.61)
  Top 0.254: IC4.16 48.82,21.03 48.68,21.17 v48.52,21.32
  Top 0.406: IC6.6 v56.78,28.95
  Bottom 0.406: v56.78,28.95 56.14,28.95 v48.52,21.32
ALARM_LED  (via drill 0.5, 0.51 pad 0.61)
  Top 0.254: IC4.21 46.32,20.99 46.15,21.16
  Top 0.406: R28.2 v4.08,31.17 | v44.4,21.32 44.72,21.64 45.67,21.64 46.15,21.16
  Bottom 0.406: v4.08,31.17 4.08,25.77 8.84,21.01 44.08,21.01 v44.4,21.32
BOOST_EN  (via drill 0.5, 0.51 pad 0.61)
  Top 0.254: IC4.20 46.82,21.44 45.98,22.28 45.83,22.28
  Top 0.406: U$1.4 13.6,33.5 v13.6,34.34 | v43.76,22.28 45.83,22.28
  Top 0.61: R37.2 v9.79,30.85
  Bottom 0.406: v13.6,34.34 13.76,34.18 13.76,31.96 12.65,30.85 v9.79,30.85 8.2,30.85 7.57,30.21 7.57,23.23 9.16,21.64 43.13,21.64 v43.76,22.28
DIGIPOT_SPI_#CS  (via drill 0.5, 0.51 pad 0.61)
  Top 0.254: IC1.5 51.17,30.11 v51.38,29.9 | IC4.25 40.04,16.77 39.93,16.88 39.93,16.9 39.9,16.93
  Top 0.406: 39.9,16.93 38.68,18.15 38.68,18.79 39.63,19.74 R4.1 41.01,21.11 45.35,25.45 v45.98,25.45
  Bottom 0.406: v51.38,29.9 51.38,28.63 47.89,25.14 46.3,25.14 v45.98,25.45
DIGIPOT_SPI_CLK  (via drill 0.5, 0.51 pad 0.61)
  Top 0.254: IC1.6 55.4,30.11 v55.19,29.9 | IC4.26 39.6,16.27 39.47,16.41 39.45,16.43
  Top 0.406: 39.45,16.43 38.05,17.83 38.05,19.1 42.17,23.23 v42.17,23.86
  Bottom 0.406: v55.19,29.9 54.56,29.9 48.52,23.86 45.35,23.86 45.03,24.18 42.49,24.18 v42.17,23.86
DIGIPOT_SPI_MOSI  (via drill 0.5, 0.51 pad 0.61)
  Top 0.254: IC1.7 v56.6,31.62 | IC4.28 42.16,15.27 41.65,15.79 39.14,15.79 39,15.93
  Top 0.406: 39,15.93 37.41,17.52 37.41,19.42 41.22,23.23 v41.22,24.5
  Bottom 0.406: v56.6,31.62 55.33,31.62 48.21,24.5 45.67,24.5 45.35,24.82 41.54,24.82 v41.22,24.5
GND  (via drill 0.5, 0.5 pad 0.61, 0.5 pad 0.81)  (3 unrouted)
  Top 0.254: 48.32,10.33 48.52,10.53 | IC4.8 51.18,14.77 v50.43,14.02 | 49.82,10.5 49.19,10.5 v48.84,10.85 48.52,10.85 48.32,10.64 IC4.44 | IC4.47 49.82,10.5 | 49.82,10.5 49.8,10.53 | CONN_SENSOR.P$10 41.25,41.86 | 41.25,41.86 41.5,41.86 | 40.75,41.86 CONN_SENSOR.P$9 40.75,42.86 | 40.75,41.86 41.25,41.86 | 40.37,41.86 40.25,41.98 CONN_SENSOR.P$8 40.25,43.85 40.27,43.87 | 40.37,41.86 40.57,41.86 | 40.57,41.86 40.75,41.86 | CONN_SENSOR.P$7 39.75,41.86 | 39.75,41.86 40.37,41.86 | 36.75,41.86 CONN_SENSOR.P$1 36.75,42.99 | 37.25,41.86 CONN_SENSOR.P$2 37.25,42.99 | 37.75,41.86 CONN_SENSOR.P$3 37.75,42.99 | 40.25,46.61 CONN_SENSOR.P$13 40.25,47.86 | 39.75,46.61 CONN_SENSOR.P$14 39.75,47.86 | 40.75,47.86 CONN_SENSOR.P$12 40.75,43.02 | 41.25,47.86 CONN_SENSOR.P$11 41.25,43.02 | 39.25,47.86 CONN_SENSOR.P$15 39.25,44.64 | 39.75,43.02 CONN_SENSOR.P$7 | CONN_SENSOR.P$7 39.75,46.52 | 36.75,41.86 37.25,41.86 | 37.25,41.86 38.25,41.86 CONN_SENSOR.P$4 38.25,42.99 | 36.75,41.86 36.5,41.86 36.25,42.11 | 39.5,41.86 39.75,41.86 | 39.25,41.8 CONN_SENSOR.P$6 | CONN_SENSOR.P$6 39.25,44.61 | 40.57,41.86 40.82,41.61 40.82,41.36 | IC4.35 44.04,11.77 44.07,11.8 | IC1.4 52.52,31.62 | 52.34,32.76 52.2,32.62 50.56,32.62 49.48,33.71 | 39.25,43.02 CONN_SENSOR.P$6 | 36.75,41.86 36.78,41.84 v36.78,41.48 | v52.97,42.28 53.92,42.28
  Top 0.305: IC4.44 48.32,8.74 | IC4.47 49.82,8.34 | 44.05,11.77 42.34,11.77 42.17,11.6 42.17,11.16 | 45.32,17.52 45.35,17.52 | IC4.23 45.32,17.54 v45.67,17.2 | 55.19,41.01 52.02,41.01 | 67.26,35.61 65.03,35.61
  Top 0.406: C35.1 v39.95,18.47 | 44,44.86 42.2,44.86 | CON_JTAG.8 v49.8,5.45 | 42.49,7.36 41.86,6.72
  Top 0.61: v39.95,18.47 40.91,18.47 | 19.32,33.07 19.32,34.34 18.68,34.98 | 20.9,4.82 22.49,4.82 23.12,4.18 23.12,1.96 | 22.49,3.86 v21.86,3.23 v21.86,1.96
  Bottom 0.305: v39.95,18.47 41.22,18.47 41.86,19.1
  Bottom 0.406: CON_JTAG.8 v49.8,5.45
  other vias: 21.86,39.42 37.09,38.15 60.91,12.12 34.55,38.15 60.91,15.93 58.69,17.83 60.91,14.66 58.37,10.21 56.14,17.83 14.23,22.59 59.95,17.83 12.96,22.59 24.39,39.42 27.57,40.06 25.35,38.79 39.95,7.36 44.4,12.44 62.18,26.09 70.43,25.14 74.56,24.82 68.84,31.48 53.29,17.2 41.54,10.53 50.27,8.31 19.63,0.69 17.41,40.06 21.22,40.69 33.28,38.15 17.73,23.23 57.1,10.21 57.41,17.83 75.19,28.95 42.12,47.36 29.79,26.72 23.76,23.55 29.79,29.26 23.12,39.42 77.1,8.62 71.7,25.14 69.48,32.44 72.66,27.36 32.97,36.88 32.97,34.34 43.13,33.39 32.97,35.61 26.3,40.06 39,13.71 60.91,13.39 43.45,46.73 33.6,43.87 14.87,32.44 14.87,33.71 14.87,31.17 17.25,32.6 17.25,34.18 17.25,35.77 17.73,24.82 17.41,25.93 23.76,32.44 19,27.68 21.54,27.68 17.41,38.79 22.49,32.76 19.32,31.8 12.33,34.5 16.3,26.24 37.09,7.36 19.95,40.69 21.22,23.86 29.79,38.15 29.79,39.42 28.84,40.06 35.83,43.23 15.82,36.88 69.48,0.69 42.12,43.31 49,8.31 12.81,32.44 16.77,37.84 10.43,31.8 11.06,34.5 19.32,3.23 21.54,0.69 18.68,23.86 42.17,38.79 37.89,41.33 35.83,38.15 69.16,25.14 25.03,30.53 25.03,31.8 25.03,33.07 25.03,34.34 50.75,17.2 58.37,14.34 56.78,14.34 45.98,10.85 20.59,3.23 34.24,33.87 14.87,35.3 18.68,40.69 60.91,26.09 62.5,28.95 62.18,27.68 23.12,0.69 38.05,12.75 55.51,18.79 10.43,33.23 24.71,0.69 26.3,0.69 8.52,27.36 54.56,19.74 29.16,34.34 29.79,25.45 29.79,27.99 35.83,42.12 42.81,41.33 40.91,38.79 43.45,42.6 44.08,44.19 44.08,45.45 34.55,43.23 32.33,43.87 18.36,33.07 29.79,24.18 28.84,23.55 27.57,23.55 26.3,23.55 15.5,22.59 25.03,23.55 16.77,22.59 22.49,23.55 29.16,30.53 19.95,23.86 51.38,7.67 59.64,10.21 59.64,14.02 37.73,40.06 41.32,41.33 35.98,33.87 40.91,37.2 40.91,35.61 40.91,34.34 39.63,41.33 45.98,37.84 45.98,39.11 25.35,26.09 25.35,24.82 29.79,35.61 29.79,36.88 52.65,7.67 53.92,7.67 55.19,7.67 55.19,8.78 55.19,9.89 53.92,10.21 44.4,14.66 19.32,30.53 20.27,27.04 39.95,48.31 41.22,48.31 24.71,48.31 38.68,48.31 37.41,48.31 36.14,48.31 34.87,48.31 33.6,48.31 32.33,48.31 25.98,48.31 29.79,48.31 28.52,48.31 27.25,48.31 24.71,47.04 31.06,48.31 9.47,22.91 8.52,23.55 8.52,29.9 8.52,28.63 8.52,26.09 8.52,24.82 44.72,33.39 45.03,31.17 75.83,25.14 36.14,31.64 37.25,30.85 38.68,30.53 39.95,30.53 41.22,30.53 42.49,30.53 27.89,41.01 26.62,41.33 25.35,41.33 24.08,41.33 22.81,41.33 21.54,41.96 21.22,43.23 21.22,44.5 21.22,45.77 21.86,47.04 23.28,47.04 32.02,42.6 30.43,41.64 12.01,0.69 12.01,3.55 12.01,6.4 12.01,12.12 12.01,16.56 12.01,18.79 14.55,0.69 17.09,0.69 29.79,0.69 27.89,0.69 32.33,0.69 37.41,0.69 39.95,0.69 42.49,0.69 14.55,3.23 17.09,3.23 60.91,17.2 60.91,10.85 17.41,18.79 19.95,18.79 22.49,18.79 25.03,18.79 27.57,18.79 30.11,18.79 15.82,18.79 12.01,14.34 62.5,30.21 45.35,41.01 46.3,40.38 47.26,41.01 52.34,43.87 54.56,42.28 55.51,43.23 56.78,43.87 58.05,43.87 59.32,43.87 44.08,7.36 70.75,36.56 61.86,31.17 59.64,31.17 60.59,32.12 57.73,31.48 61.86,36.88 63.45,31.17 65.03,31.17 49,33.39 47.73,33.39 46.14,33.39 51.38,34.02 51.38,36.56 57.73,35.93 55.83,34.34 54.24,34.34 52.65,34.34 52.65,32.76 53.92,32.76 53.92,31.48 52.65,31.48 53.29,12.44 53.61,11.32 68.21,28.95 72.97,28.63 73.92,29.58 75.19,31.8 74.88,33.07 74.88,30.53 73.29,39.9 73.29,38.79 74.56,37.52 75.51,36.88 65.99,36.88 67.26,36.88 67.26,38.15 60.59,39.42 60.59,40.69 75.51,35.61 76.47,34.66 77.1,33.39 77.1,32.12 77.1,30.85 77.1,29.58 77.1,28.31 77.1,27.04 77.1,25.77 72.66,26.09 72.34,40.53 69.8,40.69 71.07,40.53 68.53,40.69 67.42,40.22 60.91,27.68 60.91,28.95 60.91,30.21 60.59,41.96 60.59,43.23 43.76,30.53 65.35,25.14 65.35,23.23 70.43,23.23 69.16,23.23 67.89,23.23 72.66,22.91 70.75,21.32 60.59,21.32 63.13,21.32 65.67,21.32 68.21,21.32 71.07,24.18 66.62,23.23 31.7,41.33 32.33,40.38 32.33,39.11 32.65,30.53 33.6,29.58 37.41,27.68 38.68,27.68 39.95,27.68 41.22,27.68 42.49,27.68 43.76,27.68 45.03,27.68 46.3,27.83 47.57,28.63 47.89,30.21 48.84,28.95 50.11,28.95 47.73,8.31 53.29,5.77 29.16,47.36 58.37,22.28 57.1,21.64 55.83,21.64 54.56,21.64 53.29,21.64 59.32,21.32 61.86,21.32 64.4,21.32 66.94,21.32 69.48,21.32 71.7,21.96 73.61,23.86 37.09,11.8 36.46,10.85 36.46,9.58 36.46,8.31 47.57,14.02 40.27,14.34 34.87,0.69 44.08,0.69 54.24,0.69 66.94,0.69 64.4,0.69 61.86,0.69 59.32,0.69 56.78,0.69 69.48,3.23 54.24,3.23 66.94,3.23 64.4,3.23 61.86,3.23 59.32,3.23 56.78,3.23 69.48,5.77 54.24,5.77 66.94,5.77 64.4,5.77 61.86,5.77 59.32,5.77 56.78,5.77 69.48,8.62 59.32,8.31 74.56,8.62 72.02,8.62 77.1,23.86 77.1,21.32 74.56,21.32 77.1,18.79 69.48,18.79 74.56,18.79 72.02,18.79 77.1,16.24 69.48,16.24 74.56,16.24 77.1,13.71 69.48,13.71 74.56,13.71 77.1,11.16 69.48,11.16 74.56,11.16 72.02,11.16 66.94,18.79 64.4,18.79 61.86,18.79 64.4,16.24 66.94,16.24 66.94,13.71 64.4,13.71 57.1,19.74 59.64,19.74 34.24,10.21 34.24,14.97 36.78,14.97 77.1,40.38 77.1,37.84 74.56,40.38 69.48,48.31 66.94,48.31 64.4,48.31 61.86,48.31 59.32,48.31 56.78,48.31 54.24,48.31 51.7,48.31 49.16,48.31 46.62,48.31 44.08,48.31 69.48,45.77 66.94,45.77 64.4,45.77 61.86,45.77 59.32,45.77 56.78,45.77 54.24,45.77 51.7,45.77 49.16,45.77 46.62,45.77 69.48,43.23 66.94,43.23 64.4,43.23 61.86,43.23 50.43,42.91 47.89,43.87 8.52,48.31 11.06,48.31 13.6,48.31 16.14,48.31 18.68,48.31 21.22,48.31 18.68,45.77 16.14,45.77 16.14,43.23 18.68,43.23 13.6,43.23 11.06,43.23 8.52,43.23 8.52,45.77 11.06,45.77 13.6,45.77 0.9,40.38 3.44,40.38 5.98,40.38 8.52,40.38 8.52,37.84 3.44,37.84 0.9,37.84 33.6,41.64 35.19,40.06 8.52,35.3 8.52,32.76 3.44,35.3 0.9,35.3 0.9,32.76 0.9,30.21 0.9,27.68 0.9,25.14 0.9,22.59 0.9,19.74 3.44,22.59 3.12,28.95 6.3,31.8 12.96,36.25 11.06,37.84 10.74,41.01 16.77,41.64 67.26,7.99 67.26,10.53 65.35,12.44 62.18,12.12 61.23,7.36 57.1,8.31 47.26,26.09 44.72,26.09 42.17,26.09 39,24.18 40.27,23.55 53.29,27.36 52.34,26.41 51.06,25.14 48.52,27.36 52.65,30.21 39,22.59 38.37,25.77 54.56,28.63 35.51,10.21 44.72,23.23 40.27,26.09 41.33,44.84 39.93,44.84 47.26,22.28
  pour Top (isolate 0.254, rank 5): 0,41.25 7.75,41.25 7.75,49 70.24,49 70.24,41.36 78,41.36 78,7.75 70.25,7.75 70.25,0 11.24,0 11.24,18.55 0,18.55
  pour Bottom (isolate 0.254, rank 6): 0,41.25 7.75,41.25 7.75,49 70.24,49 70.24,41.36 78,41.36 78,7.75 70.25,7.75 70.25,0 11.24,0 11.24,18.55 0,18.55
  pour Route2 (isolate 0.254, rank 6): 0,41.25 7.75,41.25 7.75,49 70.25,49 70.25,41.25 78,41.25 78,7.75 70.25,7.75 70.25,0 7.75,0 7.75,7.75 0,7.75
  pour Route15 (isolate 0.254, rank 6): 0,41.25 7.75,41.25 7.75,49 70.25,49 70.25,41.25 78,41.25 78,7.75 70.25,7.75 70.25,0 7.75,0 7.75,7.75 0,7.75
HEARTBEAT_LED  (via drill 0.5)
  Top 0.305: IC4.22 45.82,20.22 v45.35,20.69
  Top 0.406: R30.2 v4.08,24.18
  Bottom 0.406: v4.08,24.18 4.71,24.18 8.52,20.37 45.03,20.37 v45.35,20.69
IF  (via drill 0.5)
  Top 0.406: IC6.2 R44.2 C41.1 66.62,26.3 v66.62,25.14
  Bottom 0.406: TP_ADC_IN.TP 67.26,24.5 v66.62,25.14
JTAG_RST  (via drill 0.5)
  Top 0.305: IC4.7 52.9,14.27 53.29,14.66 v53.29,14.97
  Bottom 0.406: v53.29,14.97 56.14,12.12 56.14,7.36 55.51,6.72 49.16,6.72 48.52,6.09 CON_JTAG.2
JTAG_TCK  (via drill 0.5)
  Top 0.305: IC4.37 44.82,9.05 44.4,8.62 v44.08,8.62
  Bottom 0.406: v44.08,8.62 44.72,8.62 47.26,6.09 CON_JTAG.3
JTAG_TDI
  Top 0.305: IC4.38 45.32,7.38 45.98,6.72 CON_JTAG.5
JTAG_TDO
  Top 0.305: IC4.39 45.82,8.15 47.26,6.72 CON_JTAG.6
JTAG_TMS  (via drill 0.5)
  Top 0.305: IC4.34 41.7,12.27 v41.22,11.8
  Bottom 0.406: CON_JTAG.4 45.98,5.77 45.35,6.4 43.76,6.4 42.49,7.67 42.49,11.16 41.86,11.8 v41.22,11.8
JTAG_TRST
  Top 0.305: IC4.40 46.32,8.61 48.52,6.4 CON_JTAG.7
N$1
  Top 0.406: IC8.6 37.2,37.2 C6.1 R10.1 R8.2
N$2
  Top 0.406: IC8.7 37.73,35.93 36.88,35.08 | 36.88,35.08 C6.2 R10.2 | 36.88,35.08 36.88,32.65 37.73,31.8 C8.1
N$3
  Top 0.254: CONN_SENSOR.P$5 38.75,40.41 R9.2
  Top 0.406: IC8.5 38.94,39.89 R9.2
N$4
  Top 0.61: R15.1 C7.2
N$5
  Top 0.61: IC8.2 45.35,35.93 45.88,36.46 C10.1 R17.1 R13.2
N$6
  Top 0.61: IC8.1 46.2,34.66 C10.2 | C10.2 R17.2 | C7.1 C10.2
N$7
  Top 0.406: IC8.3 42.81,37.2 42.17,36.56 42.17,32.02 R11.2 C8.2
N$8
  Top 0.406: R12.2 47.89,42.91 48.21,42.6 | R15.2 48.84,40.06 48.21,40.69 48.21,42.6 | 48.21,42.6 49.92,44.31 R12.3 49.9,44.19 50.75,44.19 51.38,43.55 C12.1
  Top 0.61: IC9.6 51.48,39.74 C12.1
N$9
  Top 0.406: C12.2 50.53,37.94 | 50.53,37.94 50.11,37.52 R23.1 | R12.1 50.3,41.52 50.11,41.33 50.11,38.36 50.53,37.94
  Top 0.61: IC9.7 52.34,38.47 51.8,37.94 C12.2
N$10
  Top 0.406: Q2.2 33.6,24.28 R33.2 33.5,23.76 32.97,23.23 J_RF_MODULE_VDD.2
N$11
  Top 0.254: IC1.1 51.02,33.12 50.11,34.02 R23.2
N$12
  Top 0.61: Q2.3 31.38,29.41 R7.2
N$13
  Top 0.61: C2.2 R6.2 35.35,7.3 CON_USB.GND@2
  Route2 1.016: CON_USB.GND@1 CON_USB.GND@2
  Route15 1.016: CON_USB.GND@2 CON_USB.GND@1
N$14
  Top 0.406: IC9.2 60.27,38.47 60.91,37.84 60.91,35.72 C11.1 | R14.2 C11.1 | C11.1 R18.1
N$15
  Top 0.406: IC9.1 58.75,35.97 C11.2 R18.2 59.11,33.61 59.64,33.07 61.54,33.07 62.08,32.54 R20.1
N$16
  Route2 0.254: 36.14,5.13 36.14,5.77 35.83,6.09 34.87,6.09 34.4,5.61 34.4,2.88 34.87,2.4 35.83,2.4 36.14,2.72 36.14,3.36
N$17
  Top 0.406: R20.2 R22.1 C13.1 64.82,34.34 IC2.6
N$18
  Top 0.406: C15.1 68.53,36.56 68.84,36.25 68.84,33.71 68.21,33.07 IC2.7 65.67,33.07 65.14,32.54 C13.2 R22.2
N$19
  Route2 0.254: 41.86,3.36 41.86,2.72 42.17,2.4 43.13,2.4 43.6,2.88 43.6,5.61 43.13,6.09 42.17,6.09 41.86,5.77 41.86,5.13
N$20
  Top 0.203: CON_USB.D+ R27.1
  Top 0.35: 39,8.62 R27.1
N$21
  Top 0.406: C15.2 R24.1
N$22
  Top 0.254: IC9.3 57.41,39.74 56.78,39.11 56.78,34.02 55.88,33.12 IC1.10
N$24
  Route15 0.254: 36.14,5.13 36.14,5.77 35.83,6.09 34.87,6.09 34.4,5.61 34.4,2.88 34.87,2.4 35.83,2.4 36.14,2.72 36.14,3.36
N$25
  Route15 0.254: 41.86,3.36 41.86,2.72 42.17,2.4 43.13,2.4 43.6,2.88 43.6,5.61 43.13,6.09 42.17,6.09 41.86,5.77 41.86,5.13
N$28
  Top 0.406: R24.2 69.8,33.71 70.43,33.07 IC2.2 73.61,33.07 74.24,32.44 74.24,31.17 73.29,30.21 C17.1 R26.1 71.6,27.77 D4.C D2.A
N$29
  Top 0.406: Q1.1 35.19,25.03 R34.1 R32.1
N$30
  Top 0.61: R49.1 L5.1 54.11,25.54 R48.2
N$31  (via drill 0.5)
  Top 0.406: Q1.3 34.38,28.14 v34.24,27.99 | v31.06,27.99 31.06,26.58 Q2.1 31.7,24.28 R33.1
  Bottom 0.406: v34.24,27.99 v31.06,27.99
N$34
  Top 0.406: U$1.1 17.45,31.45 D5.A
  pour Top (no thermals): 17.93,31.22 17.93,29.32 15.39,29.32 15.39,29.95 16.03,30.59 16.03,31.17 16.77,31.17
N$36
  Top 0.406: IC6.1 64.16,25 C46.1 R47.2
N$37
  Top 0.406: R36.1 11.06,30.95 C26.1 11.84,31.45 U$1.5
N$38
  Top 0.254: D6.A 19.32,25.72 19.2,25.83
  Top 0.406: D6.A D7.C | 19.2,25.83 17.62,27.42 C32.1
N$39
  Top 0.406: C36.2 R39.1 R40.2 R38.1 21.86,36.88
N$40
  Top 0.406: R40.1 R41.2
N$41
  Top 0.406: U$1.3 16.07,35.86 17.09,36.88 R38.2
N$42
  Top 0.406: IC2.1 70.75,31.8 69.9,30.95 C17.2 R26.2 69.9,27.77 D4.A | D4.A D2.C | R44.1 D4.A
N$43
  Top 0.203: CON_USB.D- 38.2,7.52 37.73,7.99 R29.1
N$44
  Top 0.305: C19.2 54.02,12.97 53.72,13.27 IC4.5
  Top 0.406: X1.3 59.57,12.19 58.37,13.39 55.61,13.39 C19.2
N$45
  Top 0.254: 55.19,14.97 C18.2 55.09,14.66
  Top 0.305: IC4.6 53.67,13.77 54.56,14.66 55.09,14.66
  Top 0.406: C18.2 55.7,14.76 X1.1
N$46
  Top 0.406: ALARM_LED.A 4.18,34.02 R28.1
N$47
  Top 0.406: HEARTBEAT_LED.A 4.18,27.04 R30.1
N$141
  Top 0.406: C39.2 25.03,27.8 L4.1 25.66,28.18 25.66,27.68 26.72,26.62 R46.2 R42.2
  pour Top (rank 3, no thermals): 21.86,28.63 21.86,29.58 22.17,29.9 23.76,29.9 24.08,29.58 24.08,27.04 23.44,27.04
N$522
  Top 0.406: R39.2 C36.1 23.76,36.78 R43.2 24.18,35.61 25.35,35.61 25.54,35.8 L3.1 25.66,36.7 25.66,37.52 26.72,38.57 R45.2 | 21.88,35.19 C40.1
  Top 0.813: R43.2 21.88,35.19 | C40.1 21.67,34.16 21.12,33.61 C38.1 21.12,32.22 21.54,31.8 D5.C
SENS_LVL  (via drill 0.51 pad 0.61)
  Top 0.254: IC4.17 48.32,19.3 v47.89,19.74
  Top 0.406: v5.03,21.96 5.34,21.96 5.98,21.32 5.98,21.01
  Bottom 0.406: v47.89,19.74 7.89,19.74 5.66,21.96 v5.03,21.96
  pour Top (rank 3): 5.98,21.32 5.66,21.01 5.66,19.1 6.3,19.1 6.3,21.01
SENSOR_ENABLE
  Top 0.254: IC4.29 41.88,14.77 41.49,15.16 38.81,15.16 38.68,15.29
  Top 0.406: 38.68,15.29 36.78,17.2 36.78,20.05 37.41,20.69 R32.2
SENSOR_VDD  (via drill 0.5)
  Top 0.254: CONN_SENSOR.P$16 38.75,47.37 38.25,47.37 | CONN_SENSOR.P$17 38.25,47.37 | 38.25,47.37 37.75,47.37 | CONN_SENSOR.P$18 37.75,47.37 | 37.75,47.37 37.25,47.37 | CONN_SENSOR.P$19 37.25,47.37 | 37.25,47.37 36.75,47.37 CONN_SENSOR.P$20 36.75,47.07 36.46,47.36
  Top 0.61: 36.46,47.36 34.02,47.36 C20.2 C5.1 31.46,46.94 C1.1 | R5.1 28.34,46.33 L6.2 29.58,45.9 C1.1 | C1.1 v30.43,47.36
  Bottom 0.406: v30.43,47.36 31.06,46.73 TP_RF_MODULE_VDD.TP
SENSOR_VDD1
  Top 0.406: 24.84,43.97 L6.1
  Top 0.61: 24.84,43.97 C51.2 C52.1 22.49,42.91 23.12,42.28 28.2,42.28 29.79,40.69 30.74,40.69 31.38,40.06 R7.1 | L6.1 25.54,46.33 R5.2
  Top 0.813: 25.66,44.53 L6.1
USB_+5V
  Top 0.61: 37.4,5.12 36.78,4.5 36.78,1.96 36.46,1.64 33.92,1.64 33.6,1.96 F1.1
  Top 0.813: CON_USB.VBUS 37.4,5.12
USB_+5V_FUSED  (via drill 0.5)
  Top 0.406: v29.48,3.23 29.37,3.23 C21.1
  Top 0.61: F1.2 C21.1 28.1,3.76 IC5.3 27.66,4.09
  Top 0.813: J_RF_MODULE_VDD.1 34.49,18.85 v34.55,18.79
  Bottom 0.406: v34.55,18.79 33.28,17.52 33.28,3.86 32.65,3.23 v29.48,3.23
USB_D+  (1 unrouted)
  Top 0.203: IC4.33 42.4,12.77 42.33,12.85 40.29,12.85 38.61,11.17 38.61,10.81
  Top 0.254: R31.1 R27.2
USB_D-  (1 unrouted)
  Top 0.203: IC4.32 42.41,13.27 42.33,13.2 40.16,13.2 38.13,11.18 38.13,10.82
USB_ENABLE  (via drill 0.5 pad 0.61)
  Top 0.254: v41.54,7.99 40.91,7.99 40.27,8.62 R31.2
  Top 0.305: IC4.31 41.79,13.77 v41.54,14.02
  Bottom 0.406: v41.54,7.99 39.95,9.58 39.95,12.44 v41.54,14.02
V+  (via drill 0.5)  (2 unrouted)
  Top 0.254: IC1.9 56.33,32.62
  Top 0.406: IC8.8 38.94,33.23 C24.2 v37.73,33.07 | 56.33,32.62 58.37,32.62 58.5,32.62 v59,32.12 | IC9.8 53.55,35.77 C28.2 v52.02,35.61 | R45.1 28.42,36.65 L3.2 27.79,36.02 C42.1 C44.1 | v66.62,28.95 66.72,29.05 C16.2 66.72,31.65 IC2.8 | 57.97,32.62 C14.1
  Top 0.813: 27.89,33.07 v28.84,33.07
  Bottom 0.406: TP_V+.TP 27.89,33.07 v28.84,33.07
  Bottom 0.61: v28.84,33.07 33.28,33.07 33.6,32.76 | v59,32.12 59,32.76 | 59,32.76 59.64,33.39 64.72,33.39 66.62,31.48 v66.62,28.95 | 59,32.76 59,33.07 56.46,35.61 v52.02,35.61 50.75,35.61 50.11,34.98 50.11,32.44 48.84,31.17 46.62,31.17 45.03,29.58 36.78,29.58 33.6,32.76 | v37.73,33.07 37.41,32.76 33.6,32.76
V-  (via drill 0.5)
  Top 0.254: IC1.3 50.11,32.12
  Top 0.406: C25.1 44.14,39.9 IC8.4 44.14,40 44.08,40.06 v44.08,41.33 | 50.11,32.12 49.58,32.12 C9.2 49.38,32.12 v47.57,32.12 | R46.1 28.42,28.23 L4.2 27.79,28.86 C43.1 C45.1 v28.84,31.8 | 72.02,37.52 72.02,35.61 IC2.4 | C47.1 72.02,37.52 | 72.02,37.52 v73.29,37.52 | C29.1 58.75,42.44 IC9.4 58.75,42.54 58.69,42.6 v59.64,42.6
  Top 0.61: v47.57,32.12 46.62,31.17 v46.62,29.58
  Top 0.813: 28.2,31.8 v28.84,31.8
  Bottom 0.406: TP_V-.TP 27.25,31.27 C45.1 v28.84,31.8
  Bottom 0.61: v59.64,42.6 59.64,42.28 59,41.64 59,40.38 | 59,40.38 59,37.84 61.54,35.3 71.07,35.3 v73.29,37.52 | 59,40.38 58.37,41.01 50.43,41.01 49.48,41.96 44.72,41.96 v44.08,41.33 44.08,36.25 42.17,34.34 42.17,32.76 42.81,32.12 v47.57,32.12 | v28.84,31.8 32.97,31.8 36.14,28.63 45.67,28.63 v46.62,29.58
VREF
  Top 0.406: IC2.3 74.14,34.34 C50.1 75.09,34.45 76.15,33.39 76.15,28.09 R2.2 R1.1

### Text on the board
tNames: TRIPLEVEL
tDocu: 3V3 | 5V | GND | GND | TDI | TDO | TRST | GND | 375mA
bDocu: GND | GND | TMS | TCK | RST | GND